# Altium project openmv-n6.PrjPcb (part 1 of 2)
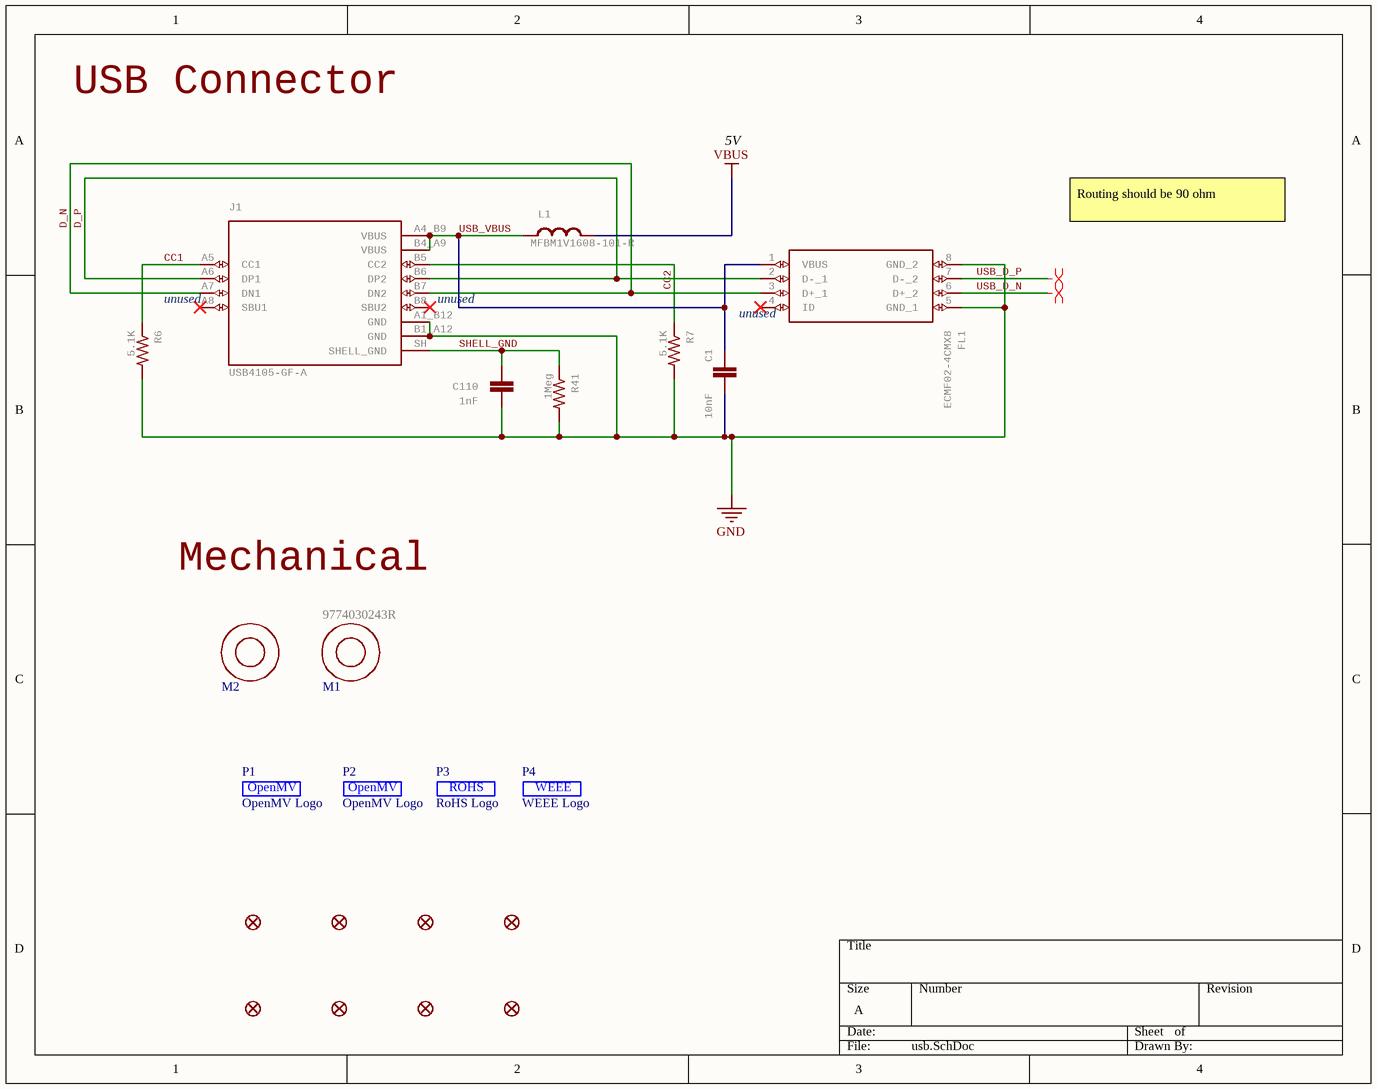
[diagram p0: usb.SchDoc]
14 sheets, 354 parts. Net scope: global (net labels, ports and power ports of the same name join across sheets).
Board file: openmv-stm32n.PcbDoc
Sheets:
  usb.SchDoc
  ideal-diode.SchDoc
  battery-charging.SchDoc
  regulators.SchDoc
  prg-flash.SchDoc
  psram.SchDoc
  imu.SchDoc
  sd-card.SchDoc
  sensor-header.SchDoc
  io-headers.SchDoc
  jtag.SchDoc
  ethernet.SchDoc
  wifi-bt.SchDoc
  stm32n657.SchDoc

## Sheet usb.SchDoc
size A

### Parts
C1  10nF  [0402-CAP]
C110  1nF  [0402-CAP]
FD1  FIDUCIAL1X2  [FIDUCIAL-1X2]  (value not drawn)
FD2  FIDUCIAL1X2  [FIDUCIAL-1X2]  (value not drawn)
FD3  FIDUCIAL1X2  [FIDUCIAL-1X2]  (value not drawn)
FD4  FIDUCIAL1X2  [FIDUCIAL-1X2]  (value not drawn)
FD5  FIDUCIAL1X2  [FIDUCIAL-1X2]  (value not drawn)
FD6  FIDUCIAL1X2  [FIDUCIAL-1X2]  (value not drawn)
FD7  FIDUCIAL1X2  [FIDUCIAL-1X2]  (value not drawn)
FD8  FIDUCIAL1X2  [FIDUCIAL-1X2]  (value not drawn)
FL1  ECMF02-4CMX8  [ECMF024CMX8]
J1  USB4105-GF-A  [GCT_USB4105-GF-A]
L1  MFBM1V1608-101-R  [0603-RES]
M1  9774030243R  [9774030243R]
M2  9774030243R  [9774030243R]  (value not drawn)
P1  OpenMV Logo  [OMV-LOGO-SMALL]  (no BOM)
P2  OpenMV Logo  [OMV-LOGO-SMALL]  (no BOM)
P3  RoHS Logo  [ROHS]  (no BOM)
P4  WEEE Logo  [WEEE]  (no BOM)
R6  5.1K  [0402-RES]
R7  5.1K  [0402-RES]
R41  1Meg  [0402-RES]

### Nets
GND: C1.2 C110.2 FL1.5(GND_1) FL1.8(GND_2) J1.A1_B12(GND) J1.B1_A12(GND) R6.2 R7.2 R41.2
VBUS: L1.2
CC1: J1.A5(CC1) R6.1
CC2: J1.B5(CC2) R7.1
D_N: FL1.3(D+_1) J1.A7(DN1) J1.B7(DN2)
D_P: FL1.2(D-_1) J1.A6(DP1) J1.B6(DP2)
SHELL_GND: C110.1 J1.SH(SHELL_GND) R41.1
USB_D_N: FL1.6(D+_2)
USB_D_P: FL1.7(D-_2)
USB_VBUS: C1.1 FL1.1(VBUS) J1.A4_B9(VBUS) J1.B4_A9(VBUS) L1.1

Not connected (* = marked no-connect by the designer): FL1 4(ID)*; J1 A8(SBU1)* B8(SBU2)*

### Layout directives
differential pair: USB_D_N, USB_D_P

### Notes on the sheet
- USB Connector
- 5V
- Routing should be 90 ohm
- unused
- (near J1) unused
- (near FL1) unused
- Mechanical
- (in symbol OMV) OpenMV

### Library data of the parts
C1 = C-EUC0201: CAPACITOR, European symbol; MPN: 0402B103K250CT; GateName_1: G$1; SymbolName_1: C-EU; POPULARITY: 0; LibraryName: rcl; DeviceSetName: C-EU; SPICEPREFIX: C; Part Number: 0402B103K250CT
C110 = CAP0402-CAP: Capacitor; MPN: VJ0402Y102JXACW1BC; GateName_1: G$1; SymbolName_1: CAP; DeviceName: 0402-CAP; LibraryName: sfe; DeviceSetName: CAP; Part Number: VJ0402Y102JXACW1BC
FD1-FD8 = FIDUCIAL1X2: Fiducial Alignment Points    Point-of-reference for pick-and-place machines and other optical instruments.; GateName_1: G$1; DeviceName: 1X2; SymbolName_1: FIDUCIAL; LibraryName: SparkFun-Aesthetics; DeviceSetName: FIDUCIAL
FL1 = ECMF02-4CMX8: Common Mode Filter & ESD Prot. USB uQFN8 STMicroelectronics ECMF02 Series, Signal Filter uQFN SMD, Flat Contact Termination, 2.6 x 1.3 x 0.6mm   Source:  Datasheet; GateName_1: G$1; SymbolName_1: ECMF02-4CMX8; LibraryName: ECMF02-4CMX8; DeviceSetName: ECMF02-4CMX8; HEIGHT: mm; MANUFACTURER_NAME: STMicroelectronics; MANUFACTURER_PART_NUMBER: ECMF02-4CMX8; MOUSER_PART_NUMBER: 511-ECMF02-4CMX8; MOUSER_PRICE-STOCK: https://www.mouser.co.uk/ProductDetail/STMicroelectronics/ECMF02-4CMX8?qs=xYt8xtm2zhmK7GoDlDZR3A%3D%3D; MPN: ECMF02-4CMX8; Part Number: ECMF02-4CMX8
J1 = USB4105-GF-A: USB-C (USB TYPE-C) USB 2.0 Receptacle Connector 24 (16+8 Dummy) Position Surface Mount, Right Angle; Through Hole  Check availability; GateName_1: G$1; MF: GCT; SymbolName_1: USB4105-GF-A; LibraryName: USB4105-GF-A; DeviceSetName: USB4105-GF-A; AVAILABILITY: In Stock; MP: USB4105-GF-A; MPN: USB4105-GF-A; PACKAGE: None; PRICE: None; PURCHASE-URL: https://pricing.snapeda.com/search/part/USB4105-GF-A/?ref=eda; Part Number: USB4105-GF-A
L1 = INDUCTOR: InductorsBasic Inductor/Choke - 0603 and 1206. Footprints are not proven and vary greatly between part numbers.; GateName_1: G$1; MPN: MFBM1V1608-101-R; Part Number: MFBM1V1608-101-R
M1 M2 = 9774030243R: M2 3mm Standoff; GateName_1: G$1; SymbolName_1: 9774030243R; LibraryName: 9774030243R; DeviceSetName: 9774030243R; MPN: 9774030243R; Part Number: 9774030243R
P1 P2 = OMV
P3 = ROHS
P4 = WEEE
R6 R7 = RESISTOR0402-RES: ResistorBasic schematic elements and footprints for 0603, 1206, and PTH resistors.; MPN: RC0402JR-075K1L; GateName_1: G$1; SymbolName_1: RESISTOR; DeviceName: 0402-RES; LibraryName: sfe; DeviceSetName: RESISTOR; Part Number: RC0402JR-075K1L
R41 = RESISTOR0402-RES: Resistor; MPN: CRCW04021M00FKEDC; GateName_1: G$1; SymbolName_1: RESISTOR; DeviceName: 0402-RES; LibraryName: sfe; DeviceSetName: RESISTOR; Part Number: CRCW04021M00FKEDC

## Sheet ideal-diode.SchDoc
size A
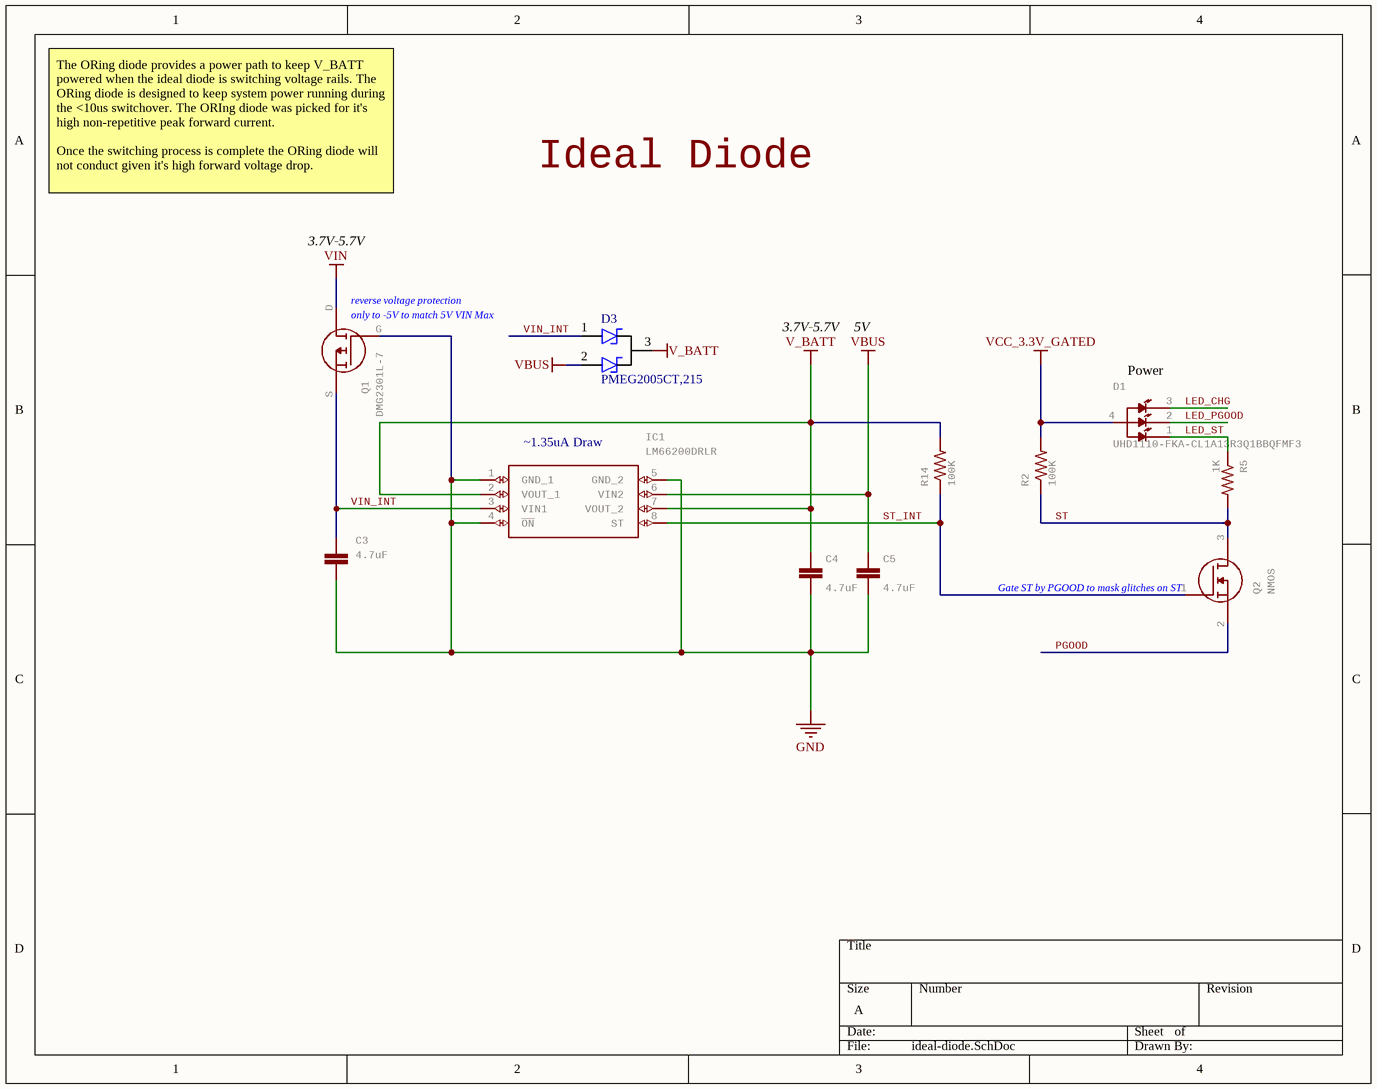
[diagram p1: ideal-diode.SchDoc]

### Parts
C3  4.7uF  [0402-CAP]
C4  4.7uF  [0402-CAP]
C5  4.7uF  [0402-CAP]
D1  UHD1110-FKA-CL1A13R3Q1BBQFMF3  [LED_UHD1110-FKA-CL1A13R3Q1BBQFMF3]
D3  MPN: PMEG2005CT,215  [SOT-23-3]  (hidden comment: Dual Schottky)
IC1  LM66200DRLR  [SOTFL50P160X60-8N]
Q1  DMG2301L-7  [SOT-23-3-FET]
Q2  NMOS  [DFN1006]
R2  100K  [0402-RES]
R5  1K  [0402-RES]
R14  100K  [0402-RES]

### Nets
GND: C3.1 C4.1 C5.1 IC1.1(GND_1) IC1.4(~{ON}) IC1.5(GND_2) Q1.G
V_BATT: C4.2 D3.3 IC1.2(VOUT_1) IC1.7(VOUT_2) R14.2
VBUS: C5.2 D3.2 IC1.6(VIN2)
VCC_3.3V_GATED: D1.4(ANODE) R2.2
VIN: Q1.D
LED_CHG: D1.3(RED)
LED_PGOOD: D1.2(GREEN)
LED_ST: D1.1(BLUE) R5.1
PGOOD: Q2.2(S)
ST: Q2.3(D) R2.1 R5.2
ST_INT: IC1.8(ST) Q2.1(G) R14.1
VIN_INT: C3.2 D3.1 IC1.3(VIN1) Q1.S

### Notes on the sheet
- Ideal Diode
- The ORing diode provides a power path to keep V_BATT powered when the ideal diode is switching voltage rails. The ORing diode is designed to keep system power running during the <10us switchover. The ORIng diode was picked for it's high non-repetitive peak forward current.
  Once the switching process is complete the ORing diode will not conduct given it's high forward voltage drop.
- 3.7V-5.7V
- (near Q1) reverse voltage protection
- (near Q1) only to -5V to match 5V VIN Max
- 5V
- (near D1) Power
- (near IC1) ~1.35uA Draw
- (near Q2) Gate ST by PGOOD to mask glitches on ST

### Library data of the parts
C3-C5 = CAP0402-CAP: CapacitorStandard 0603 ceramic capacitor, and 0.1" leaded capacitor.; MPN: JMK105BBJ475MV-F; GateName_1: G$1; SymbolName_1: CAP; DeviceName: 0402-CAP; LibraryName: sfe; DeviceSetName: CAP; Part Number: JMK105BBJ475MV-F
D1 = UHD1110-FKA-CL1A13R3Q1BBQFMF3: LED RGB SMD, SIZE 1 X 1 mm Check availability; GateName_1: G$1; MF: Cree Inc.; SymbolName_1: UHD1110-FKA-CL1A13R3Q1BBQFMF3; LibraryName: UHD1110-FKA-CL1A13R3Q1BBQFMF3; DeviceSetName: UHD1110-FKA-CL1A13R3Q1BBQFMF3; AVAILABILITY: In Stock; MP: UHD1110-FKA-CL1A13R3Q1BBQFMF3; MPN: UHD1110-FKA-CL1A13r3q1BBQFMF3; PACKAGE: 0404 Cree Inc.; PRICE: None; PURCHASE-URL: https://pricing.snapeda.com/search/part/UHD1110-FKA-CL1A13R3Q1BBQFMF3/?ref=eda; Part Number: UHD1110-FKA-CL1A13r3q1BBQFMF3
D3 = Dual Schottky: MANUFACTURER: Nexperia; Value: ?V; Part Number: PMEG2005CT,215
IC1 = LM66200DRLR: 1.6-V to 5.5-V, 40-m, 2.5-A, low-IQ, dual ideal diode   Source:  Datasheet; MANUFACTURER_NAME: Texas Instruments; GateName_1: G$1; SymbolName_1: LM66200DRLR; LibraryName: LM66200DRLR; DeviceSetName: LM66200DRLR; HEIGHT: 0.6mm; MANUFACTURER_PART_NUMBER: LM66200DRLR; MOUSER_PART_NUMBER: 595-LM66200DRLR; MOUSER_PRICE-STOCK: https://www.mouser.co.uk/ProductDetail/Texas-Instruments/LM66200DRLR?qs=Rp5uXu7WBW90hnpZAkIOdQ%3D%3D; MPN: LM66200DRLR; Part Number: LM66200DRLR
Q1 = DMG2301L-7: GateName_1: G$1; HEIGHT: 1.1mm; MPN: DMG2301L-7; Part Number: DMG2301L-7
Q2 = 2N7002KW_R1_00001: MOSFET 60V N-Channel Enhancement Mode MOSFET - ESD Protected   Source:  Datasheet
R2 R14 = RESISTOR0402-RES: ResistorBasic schematic elements and footprints for 0603, 1206, and PTH resistors.; MPN: AC0402FR-07100KL; GateName_1: G$1; SymbolName_1: RESISTOR; DeviceName: 0402-RES; LibraryName: sfe; DeviceSetName: RESISTOR; Part Number: AC0402FR-07100KL
R5 = RESISTOR0402-RES: ResistorBasic schematic elements and footprints for 0603, 1206, and PTH resistors.; MPN: CRCW04021K00FKEDC; GateName_1: G$1; SymbolName_1: RESISTOR; DeviceName: 0402-RES; LibraryName: sfe; DeviceSetName: RESISTOR; Part Number: CRCW04021K00FKEDC

## Sheet battery-charging.SchDoc
size A
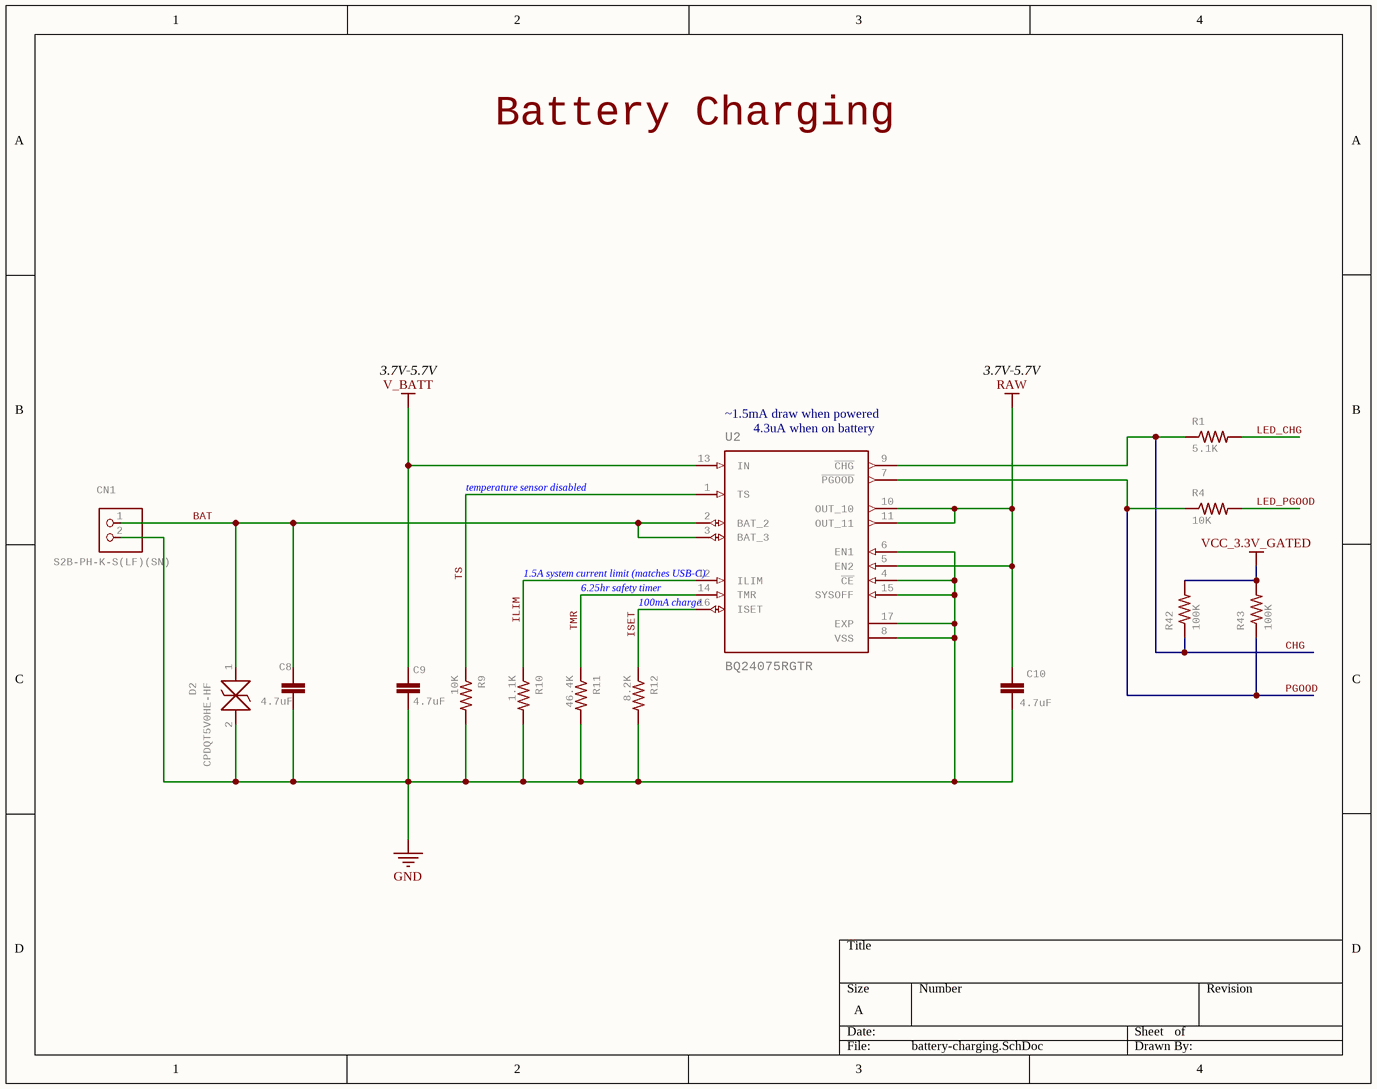
[diagram p2: battery-charging.SchDoc]

### Parts
C8  4.7uF  [0402-CAP]
C9  4.7uF  [0402-CAP]
C10  4.7uF  [0402-CAP]
CN1  S2B-PH-K-S(LF)(SN)  [JST-PH-2-THM-RA]
D2  CPDQT5V0HE-HF  [CPDQT5V0HEHF]
R1  5.1K  [0402-RES]
R4  10K  [0402-RES]
R9  10K  [0402-RES]
R10  1.1K  [0402-RES]
R11  46.4K  [0402-RES]
R12  8.2K  [0402-RES]
R42  100K  [0402-RES]
R43  100K  [0402-RES]
U2  BQ24075RGTR  [QFN50P300X300X100-17N]

### Nets
GND: C8.1 C9.1 C10.1 CN1.2 D2.2 R9.2 R10.2 R11.2 R12.2 U2.4(~{CE}) U2.6(EN1) U2.8(VSS) U2.15(SYSOFF) U2.17(EXP)
RAW: C10.2 U2.5(EN2) U2.10(OUT_10) U2.11(OUT_11)
V_BATT: C9.2 U2.13(IN)
VCC_3.3V_GATED: R42.2 R43.2
BAT: C8.2 CN1.1 D2.1 U2.2(BAT_2) U2.3(BAT_3)
CHG: R1.1 R42.1 U2.9(~{CHG})
ILIM: R10.1 U2.12(ILIM)
ISET: R12.1 U2.16(ISET)
LED_CHG: R1.2
LED_PGOOD: R4.2
PGOOD: R4.1 R43.1 U2.7(~{PGOOD})
TMR: R11.1 U2.14(TMR)
TS: R9.1 U2.1(TS)

### Notes on the sheet
- Battery Charging
- 3.7V-5.7V
- (near U2) ~1.5mA draw when powered
- (near U2) 4.3uA when on battery
- temperature sensor disabled
- (near U2) 1.5A system current limit (matches USB-C)
- (near U2) 6.25hr safety timer
- (near U2) 100mA charge

### Library data of the parts
C8-C10 = CAP0402-CAP: as C3 on sheet ideal-diode; DeviceName: 0402-CAP; LibraryName: sfe; DeviceSetName: CAP; Part Number: JMK105BBJ475MV-F
CN1 = JST_2PIN-THM-RA: JST 2-Pin Connectors of various flavors SMT-RA (S2B-PH-SM4) 4UConnector #17311  SMT  (B2B-PH-SM4)  THM-RA (S2B-PH)  THM  (B2B-PH); GateName_1: G$1; SymbolName_1: PINHD2; DeviceName: -THM-RA; LibraryName: adafruit-updated; DeviceSetName: JST_2PIN; MPN: S2B-PH-K-S(LF)(SN); Part Number: S2B-PH-K-S(LF)(SN)
D2 = CPDQT5V0HE-HF: ESD Suppressors / TVS Diodes DIODE ESD 5VWM 65W 0402/SOD-923F   Source:  Datasheet; MANUFACTURER_NAME: Comchip Technology; GateName_1: G$1; SymbolName_1: CPDQT5V0HE-HF; LibraryName: CPDQT5V0HE-HF; DeviceSetName: CPDQT5V0HE-HF; HEIGHT: 0.42mm; MANUFACTURER_PART_NUMBER: CPDQT5V0HE-HF; MOUSER_PART_NUMBER: MOUSER_PART_NUMBER; MOUSER_PRICE-STOCK: MOUSER_PRICE-STOCK; MPN: CPDQT5V0HE-HF; Part Number: CPDQT5V0HE-HF
R1 = RESISTOR0402-RES: as R6 on sheet usb; SymbolName_1: RESISTOR; DeviceName: 0402-RES; LibraryName: sfe; DeviceSetName: RESISTOR; Part Number: RC0402JR-075K1L
R4 R9 = RESISTOR0402-RES: ResistorBasic schematic elements and footprints for 0603, 1206, and PTH resistors.; MPN: AC0402FR-1310KL; GateName_1: G$1; SymbolName_1: RESISTOR; DeviceName: 0402-RES; LibraryName: sfe; DeviceSetName: RESISTOR; Part Number: AC0402FR-1310KL
R10 = RESISTOR0402-RES: ResistorBasic schematic elements and footprints for 0603, 1206, and PTH resistors.; MPN: RC0402JR-071K1; GateName_1: G$1; SymbolName_1: RESISTOR; DeviceName: 0402-RES; LibraryName: sfe; DeviceSetName: RESISTOR; Part Number: RC0402JR-071K1
R11 = RESISTOR0402-RES: ResistorBasic schematic elements and footprints for 0603, 1206, and PTH resistors.; MPN: WR04X4642FTL; GateName_1: G$1; SymbolName_1: RESISTOR; DeviceName: 0402-RES; LibraryName: sfe; DeviceSetName: RESISTOR; Part Number: WR04X4642FTL
R12 = RESISTOR0402-RES: ResistorBasic schematic elements and footprints for 0603, 1206, and PTH resistors.; MPN: CR0402-FX-8201GLF; GateName_1: G$1; SymbolName_1: RESISTOR; DeviceName: 0402-RES; LibraryName: sfe; DeviceSetName: RESISTOR; Part Number: CR0402-FX-8201GLF
R42 R43 = RESISTOR0402-RES: as R2 on sheet ideal-diode; SymbolName_1: RESISTOR; DeviceName: 0402-RES; LibraryName: sfe; DeviceSetName: RESISTOR; Part Number: AC0402FR-07100KL
U2 = BQ24075RGTR: Standalone 1-cell 1.5-A linear charger, Power Path, 4.2-V VBAT and 5.5-V VOUT 16-VQFN -40 to 85  Check availability; GateName_1: G$1; MF: Texas Instruments; SymbolName_1: BQ24075RGTR; LibraryName: BQ24075RGTR; DeviceSetName: BQ24075RGTR; AVAILABILITY: In Stock; MP: BQ24075RGTR; MPN: BQ24075RGTR; PACKAGE: VQFN-16 Texas Instruments; PRICE: None; PURCHASE-URL: https://pricing.snapeda.com/search/part/BQ24075RGTR/?ref=eda; Part Number: BQ24075RGTR

## Sheet regulators.SchDoc
size A
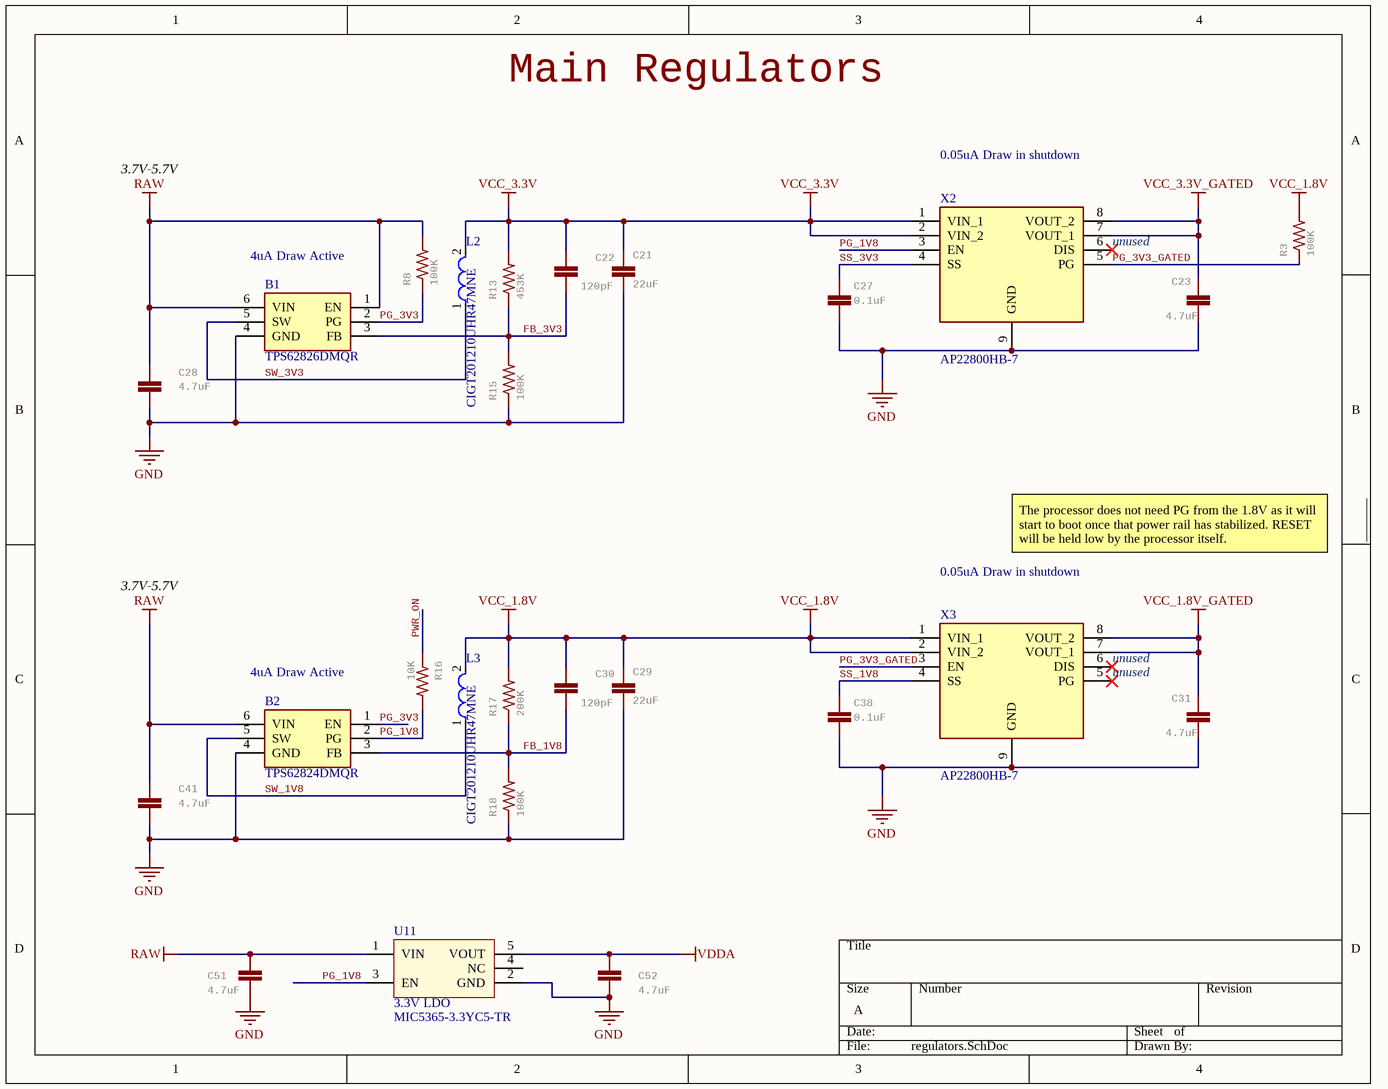
[diagram p3: regulators.SchDoc]

### Parts
B1  TPS62826DMQR  [TPS62826ADMQR]
B2  TPS62824DMQR  [TPS62826ADMQR]
C21  22uF  [0805]
C22  120pF  [0402-CAP]
C23  4.7uF  [0402-CAP]
C27  0.1uF  [0402-CAP]
C28  4.7uF  [0402-CAP]
C29  22uF  [0805]
C30  120pF  [0402-CAP]
C31  4.7uF  [0402-CAP]
C38  0.1uF  [0402-CAP]
C41  4.7uF  [0402-CAP]
C51  4.7uF  [0402-CAP]
C52  4.7uF  [0402-CAP]
L2  CIGT201210UHR47MNE  [0805]
L3  CIGT201210UHR47MNE  [0805]
R3  100K  [0402-RES]
R8  100K  [0402-RES]
R13  453K  [0402-RES]
R15  100K  [0402-RES]
R16  10K  [0402-RES]
R17  200K  [0402-RES]
R18  100K  [0402-RES]
U11  3.3V LDO  [SC70-5]
X2  AP22800HB-7  [SON50P161X211X60-9N]
X3  AP22800HB-7  [SON50P161X211X60-9N]

### Nets
GND: B1.4(GND) B2.4(GND) C21.2 C23.2 C27.1 C28.1 C29.2 C31.2 C38.1 C41.1 C51.1 C52.2 R15.1 R18.1 U11.2(GND) X2.9(GND) X3.9(GND)
RAW: B1.1(EN) B1.6(VIN) B2.6(VIN) C28.2 C41.2 C51.2 R8.2 U11.1(VIN)
VCC_1.8V: C29.1 C30.2 L3.2 R3.2 R17.2 X3.1(VIN_1) X3.2(VIN_2)
VCC_1.8V_GATED: C31.1 X3.7(VOUT_1) X3.8(VOUT_2)
VCC_3.3V: C21.1 C22.2 L2.2 R13.2 X2.1(VIN_1) X2.2(VIN_2)
VCC_3.3V_GATED: C23.1 X2.7(VOUT_1) X2.8(VOUT_2)
VDDA: C52.1 U11.5(VOUT)
FB_1V8: B2.3(FB) C30.1 R17.1 R18.2
FB_3V3: B1.3(FB) C22.1 R13.1 R15.2
PG_1V8: B2.2(PG) R16.2 U11.3(EN) X2.3(EN)
PG_3V3: B1.2(PG) B2.1(EN) R8.1
PG_3V3_GATED: R3.1 X2.5(PG) X3.3(EN)
PWR_ON: R16.1
SS_1V8: C38.2 X3.4(SS)
SS_3V3: C27.2 X2.4(SS)
SW_1V8: B2.5(SW) L3.1
SW_3V3: B1.5(SW) L2.1

Not connected (* = marked no-connect by the designer): U11 4(NC); X2 6(DIS)*; X3 5(PG)* 6(DIS)*

### Notes on the sheet
- Main Regulators
- 3.7V-5.7V
- 0.05uA Draw in shutdown
- (near X2) unused
- (near B1) 4uA Draw Active
- The processor does not need PG from the 1.8V as it will start to boot once that power rail has stabilized. RESET will be held low by the processor itself.
- (near B2) 4uA Draw Active
- (near X3) unused

### Library data of the parts
B1 = TPS62826ADMQR: Switching Voltage Regulators 2.4-V to 5.5-V input, 3-A step-down converter with in 1.5-mm 1.5-mm QFN package; Manufacturer_Name: Texas Instruments; Geometry.Height: 1mm; Mouser Part Number: 595-TPS62826DMQR; Mouser Price/Stock: https://www.mouser.co.uk/ProductDetail/Texas-Instruments/TPS62826ADMQR?qs=KUoIvG%2F9Ila3pPUbedlDEw%3D%3D; Manufacturer_Part_Number: TPS62826DMQR; Datasheet Link: https://www.ti.com/lit/ds/symlink/tps62825a.pdf?ts=1608196934558&ref_url=https%253A%252F%252Fwww.ti.com%252Fstore%252Fti%252Fen%252Fp%252Fproduct%252F%253Fp%253DTPS62825ADMQR%2526keyMatch%253DTPS62825ADMQR%2526tisearch%253DSearch-EN-everything%2526usecase; MPN: TPS62826DMQR; Part Number: TPS62826DMQR
B2 = TPS62826ADMQR: Switching Voltage Regulators 2.4-V to 5.5-V input, 1-A step-down converter in 1.5-mm 1.5-mm QFN package; Manufacturer_Name: Texas Instruments; Geometry.Height: 1mm; Mouser Part Number: 595-TPS62824DMQR; Mouser Price/Stock: https://www.mouser.co.uk/ProductDetail/Texas-Instruments/TPS62826ADMQR?qs=KUoIvG%2F9Ila3pPUbedlDEw%3D%3D; Manufacturer_Part_Number: TPS62824DMQR; Datasheet Link: https://www.ti.com/lit/ds/symlink/tps62825a.pdf?ts=1608196934558&ref_url=https%253A%252F%252Fwww.ti.com%252Fstore%252Fti%252Fen%252Fp%252Fproduct%252F%253Fp%253DTPS62825ADMQR%2526keyMatch%253DTPS62825ADMQR%2526tisearch%253DSearch-EN-everything%2526usecase; MPN: TPS62824DMQR; Part Number: TPS62824DMQR
C21 C29 = 22UF-0805-6.3V-20%: 22ÂµF ceramic capacitors    A capacitor is a passive two-terminal electrical component used to store electrical energy temporarily in an electric field.; MPN: CL21A226MQQNNNE; GateName_1: G$1; SymbolName_1: CAP; PROD_ID: CAP-08402; DeviceName: -0805-6.3V-20%; LibraryName: SparkFun-Capacitors; DeviceSetName: 22UF; Part Number: CL21A226MQQNNNE
C22 C30 = CAP0402-CAP: CapacitorStandard 0603 ceramic capacitor, and 0.1" leaded capacitor.; MPN: GRM1555C2A121GE01D; GateName_1: G$1; SymbolName_1: CAP; DeviceName: 0402-CAP; LibraryName: sfe; DeviceSetName: CAP; Part Number: GRM1555C2A121GE01D
C23 C28 C31 C41 C51 C52 = CAP0402-CAP: as C3 on sheet ideal-diode; DeviceName: 0402-CAP; LibraryName: sfe; DeviceSetName: CAP; Part Number: JMK105BBJ475MV-F
C27 C38 = C-EUC0201: CAPACITOR, European symbol; MPN: C0402C104Z4VAC; GateName_1: G$1; SymbolName_1: C-EU; POPULARITY: 0; LibraryName: rcl; DeviceSetName: C-EU; SPICEPREFIX: C; Part Number: C0402C104Z4VAC
L2 L3 = CMP-00002-1: Power Inductor : LxW size(mm) 2012 Thickness1 Inductance (uH) 20%: 0.47; Current Rating: 3.6A; Shielding: Unshielded; Test Frequency: 1MHz; DC Resistance (DCR): 31mR; Saturation Current: 5.4A; Core Material: Metal,Composite; Value: 470nH; Tolerance: 20%; Packaging: Cut Tape; Case Code (Imperial): 0805; Case/Package: 0805; RoHS Compliant: Yes; Max Operating Temperature: 125°C; Series: CIGT; Min Operating Temperature: -40°C; Mounting Technology: Surface Mount; Case Code (Metric): 2012; MPN: CIGT201210UHR47MNE; Part Number: CIGT201210UHR47MNE
R3 R8 R15 R18 = RESISTOR0402-RES: as R2 on sheet ideal-diode; SymbolName_1: RESISTOR; DeviceName: 0402-RES; LibraryName: sfe; DeviceSetName: RESISTOR; Part Number: AC0402FR-07100KL
R13 = RESISTOR0402-RES: ResistorBasic schematic elements and footprints for 0603, 1206, and PTH resistors.; MPN: CR0402-FX-4533GLF; GateName_1: G$1; SymbolName_1: RESISTOR; DeviceName: 0402-RES; LibraryName: sfe; DeviceSetName: RESISTOR; Part Number: CR0402-FX-4533GLF
R16 = RESISTOR0402-RES: as R4 on sheet battery-charging; SymbolName_1: RESISTOR; DeviceName: 0402-RES; LibraryName: sfe; DeviceSetName: RESISTOR; Part Number: AC0402FR-1310KL
R17 = RESISTOR0402-RES: ResistorBasic schematic elements and footprints for 0603, 1206, and PTH resistors.; MPN: CR0402-FX-2003GLF; GateName_1: G$1; SymbolName_1: RESISTOR; DeviceName: 0402-RES; LibraryName: sfe; DeviceSetName: RESISTOR; Part Number: CR0402-FX-2003GLF
U11 = MIC5365-3.3YC5-TR: MF: Microchip; MPN: MIC5365-3.3YC5-TR
X2 X3 = AP22800HB-7: Power Switch ICs - Power Distribution Load Switch; Manufacturer_Name: Diodes Incorporated; Geometry.Height: 0.605mm; Mouser Part Number: 621-AP22800HB-7; Mouser Price/Stock: https://www.mouser.co.uk/ProductDetail/Diodes-Incorporated/AP22800HB-7?qs=9BjnSzo86S%2FcRh3gewZ%2Ftg%3D%3D; Manufacturer_Part_Number: AP22800HB-7; Datasheet Link: https://www.diodes.com/assets/Datasheets/AP22800.pdf; MPN: AP22800HB-7; Part Number: AP22800HB-7

## Sheet prg-flash.SchDoc
size A
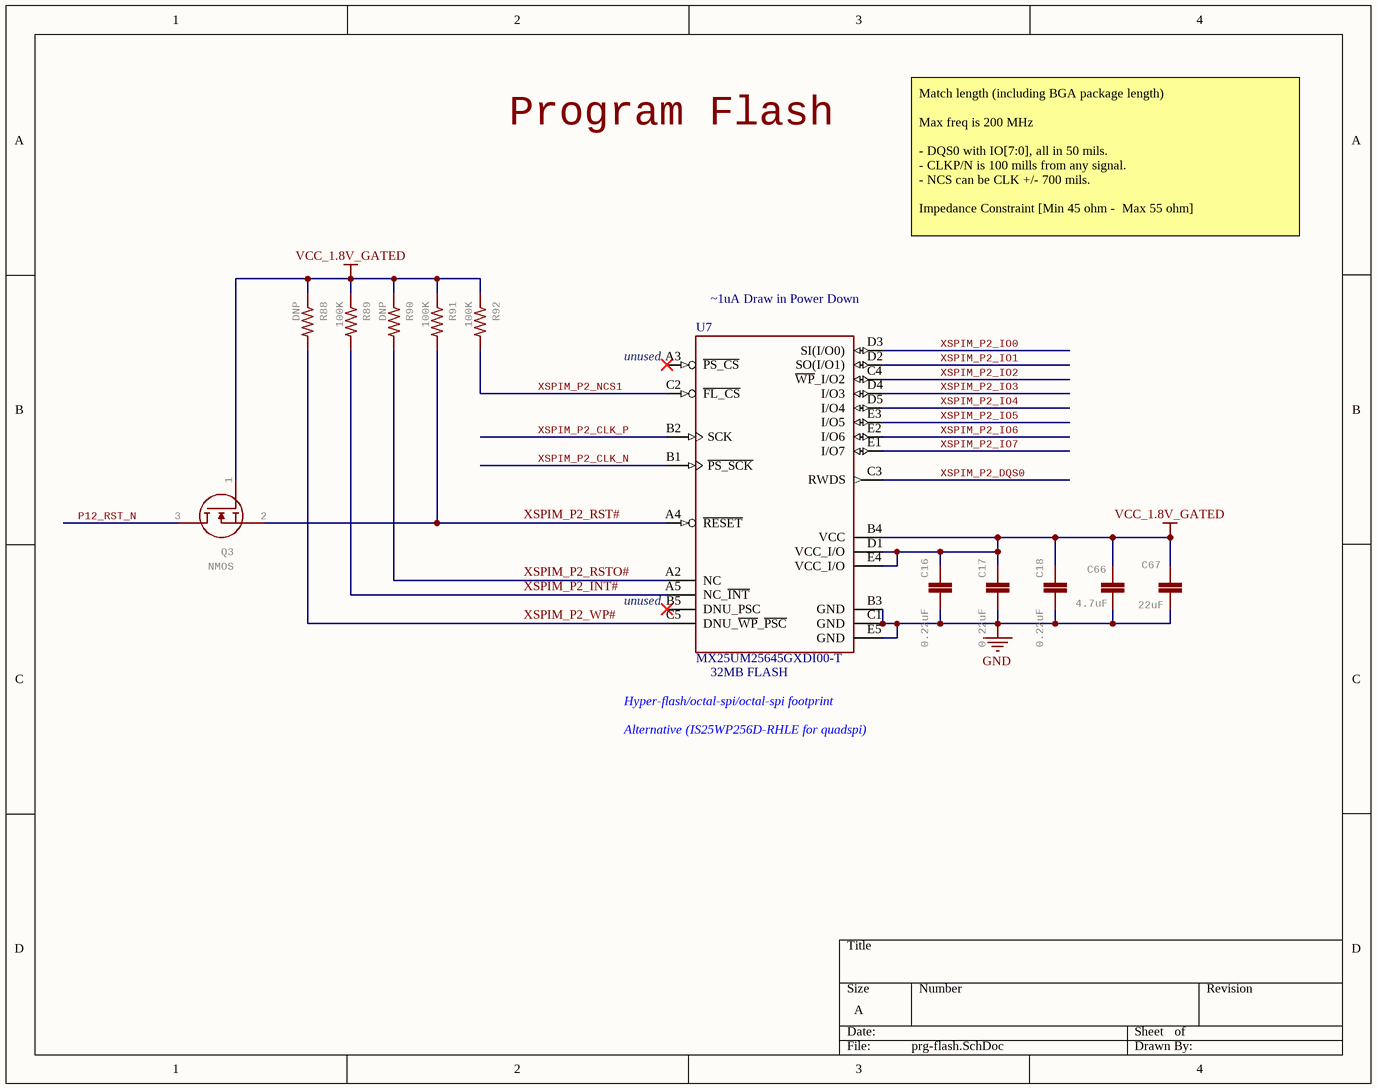
[diagram p4: prg-flash.SchDoc]

### Parts
C16  0.22uF  [C0201]
C17  0.22uF  [C0201]
C18  0.22uF  [C0201]
C66  4.7uF  [0402-CAP]
C67  22uF  [0805]
Q3  NMOS  [DFN1006]
R88  DNP  [0402-RES]
R89  100K  [0402-RES]
R90  DNP  [0402-RES]
R91  100K  [0402-RES]
R92  100K  [0402-RES]
U7  MX25UM25645GXDI00-T  [24-TBGA]

### Nets
GND: C16.2 C17.2 C18.2 C66.1 C67.1 U7.B3(GND) U7.C1(GND) U7.E5(GND)
VCC_1.8V_GATED: C16.1 C17.1 C18.1 C66.2 C67.2 Q3.1(G) R88.1 R89.1 R90.1 R91.1 R92.1 U7.B4(VCC) U7.D1(VCC_I/O) U7.E4(VCC_I/O)
P12_RST_N: Q3.3(D)
XSPIM_P2_CLK_N: U7.B1(~{PS_SCK})
XSPIM_P2_CLK_P: U7.B2(SCK)
XSPIM_P2_DQS0: U7.C3(RWDS)
XSPIM_P2_INT#: R89.2 U7.A5(NC_~{INT})
XSPIM_P2_IO0: U7.D3(SI(I/O0))
XSPIM_P2_IO1: U7.D2(SO(I/O1))
XSPIM_P2_IO2: U7.C4(~{WP}_I/O2)
XSPIM_P2_IO3: U7.D4(I/O3)
XSPIM_P2_IO4: U7.D5(I/O4)
XSPIM_P2_IO5: U7.E3(I/O5)
XSPIM_P2_IO6: U7.E2(I/O6)
XSPIM_P2_IO7: U7.E1(I/O7)
XSPIM_P2_NCS1: R92.2 U7.C2(~{FL_CS})
XSPIM_P2_RST#: Q3.2(S) R91.2 U7.A4(~{RESET})
XSPIM_P2_RSTO#: R90.2 U7.A2(NC)
XSPIM_P2_WP#: R88.2 U7.C5(DNU_~{WP}_~{PSC})

Not connected (* = marked no-connect by the designer): U7 A3(~{PS_CS})* B5(DNU_PSC)*

### Notes on the sheet
- Program Flash
- Match length (including BGA package length)
  Max freq is 200 MHz
  - DQS0 with IO[7:0], all in 50 mils.
  - CLKP/N is 100 mills from any signal.
  - NCS can be CLK +/- 700 mils.
  Impedance Constraint [Min 45 ohm -  Max 55 ohm]
- (near U7) ~1uA Draw in Power Down
- (near U7) unused
- (near U7) 32MB FLASH
- Hyper-flash/octal-spi/octal-spi footprint
- Alternative (IS25WP256D-RHLE for quadspi)

### Library data of the parts
C16-C18 = C-EUC0201: CAPACITOR, European symbol; MPN: GRM033R60J224ME15D; GateName_1: G$1; SymbolName_1: C-EU; POPULARITY: 0; DeviceName: C0201; LibraryName: rcl; DeviceSetName: C-EU; SPICEPREFIX: C; Part Number: GRM033R60J224ME15D
C66 = CAP0402-CAP: as C3 on sheet ideal-diode; DeviceName: 0402-CAP; LibraryName: sfe; DeviceSetName: CAP; Part Number: JMK105BBJ475MV-F
C67 = 22UF-0805-6.3V-20%: as C21 on sheet regulators; DeviceName: -0805-6.3V-20%; LibraryName: SparkFun-Capacitors; DeviceSetName: 22UF; Part Number: CL21A226MQQNNNE
Q3 = 2N7002KW_R1_00001: GateName_1: G$1
R88 R90 = RESISTOR0402-RES: ResistorBasic schematic elements and footprints for 0603, 1206, and PTH resistors.; GateName_1: G$1; SymbolName_1: RESISTOR; DeviceName: 0402-RES; LibraryName: sfe; DeviceSetName: RESISTOR; MPN: DNP; Part Number: DNP
R89 R91 R92 = RESISTOR0402-RES: as R2 on sheet ideal-diode; SymbolName_1: RESISTOR; DeviceName: 0402-RES; LibraryName: sfe; DeviceSetName: RESISTOR; Part Number: AC0402FR-07100KL
U7 = IS25WX256-JHLE: IC, Flash,32MB x 8, Octal SPI, Ind Temp, 1.8V,24-BGA; Part Number: MX25UM25645GXDI00-T; MPN: MX25UM25645GXDI00-T

## Sheet psram.SchDoc
size A
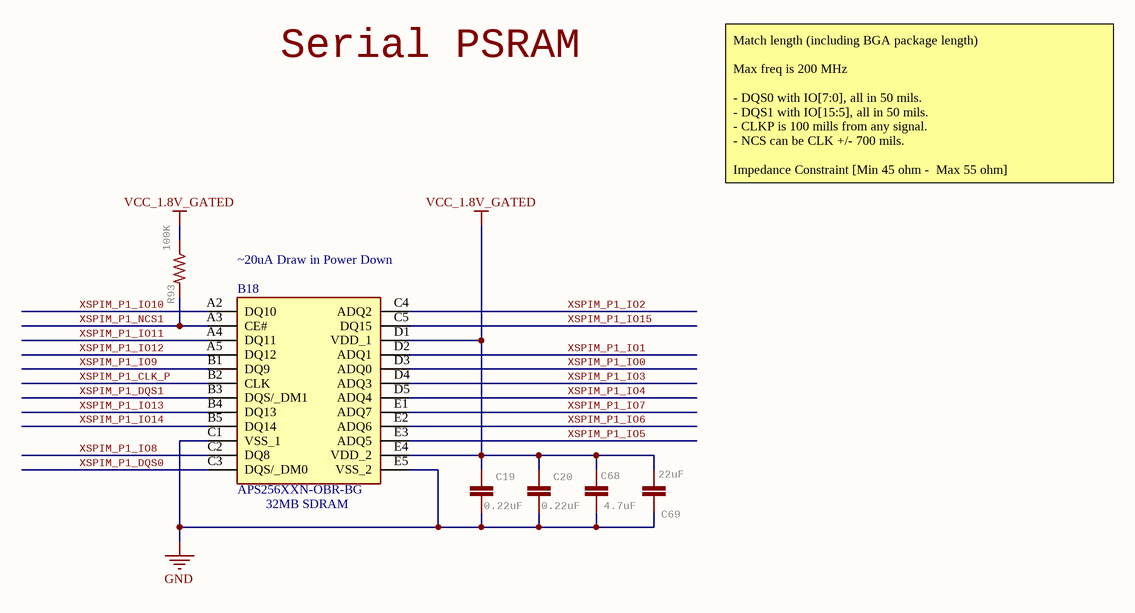
[diagram p5: psram.SchDoc]

### Parts
B18  APS256XXN-OBR-BG  [24-TBGA]
C19  0.22uF  [C0201]
C20  0.22uF  [C0201]
C68  4.7uF  [0402-CAP]
C69  22uF  [0805]
R93  100K  [0402-RES]

### Nets
GND: B18.C1(VSS_1) B18.E5(VSS_2) C19.2 C20.2 C68.1 C69.2
VCC_1.8V_GATED: B18.D1(VDD_1) B18.E4(VDD_2) C19.1 C20.1 C68.2 C69.1 R93.1
XSPIM_P1_CLK_P: B18.B2(CLK)
XSPIM_P1_DQS0: B18.C3(DQS/_DM0)
XSPIM_P1_DQS1: B18.B3(DQS/_DM1)
XSPIM_P1_IO0: B18.D3(ADQ0)
XSPIM_P1_IO1: B18.D2(ADQ1)
XSPIM_P1_IO2: B18.C4(ADQ2)
XSPIM_P1_IO3: B18.D4(ADQ3)
XSPIM_P1_IO4: B18.D5(ADQ4)
XSPIM_P1_IO5: B18.E3(ADQ5)
XSPIM_P1_IO6: B18.E2(ADQ6)
XSPIM_P1_IO7: B18.E1(ADQ7)
XSPIM_P1_IO8: B18.C2(DQ8)
XSPIM_P1_IO9: B18.B1(DQ9)
XSPIM_P1_IO10: B18.A2(DQ10)
XSPIM_P1_IO11: B18.A4(DQ11)
XSPIM_P1_IO12: B18.A5(DQ12)
XSPIM_P1_IO13: B18.B4(DQ13)
XSPIM_P1_IO14: B18.B5(DQ14)
XSPIM_P1_IO15: B18.C5(DQ15)
XSPIM_P1_NCS1: B18.A3(CE#) R93.2

### Notes on the sheet
- Serial PSRAM
- Match length (including BGA package length)
  Max freq is 200 MHz
  - DQS0 with IO[7:0], all in 50 mils.
  - DQS1 with IO[15:5], all in 50 mils.
  - CLKP is 100 mills from any signal.
  - NCS can be CLK +/- 700 mils.
  Impedance Constraint [Min 45 ohm -  Max 55 ohm]
- ~20uA Draw in Power Down
- (near B18) 32MB SDRAM

### Library data of the parts
B18 = APS256XXN-OBR-BG: DRAM IoT RAM 256Mb OPI (x8,x16) DDR 200MHz, 1.8V, Ind. Temp., BGA24; Manufacturer_Name: AP Memory; Geometry.Height: 1.2mm; Mouser Part Number: 878-APS256XXN-OBR-BG; Mouser Price/Stock: https://www.mouser.co.uk/ProductDetail/AP-Memory/APS256XXN-OBR-BG?qs=IS%252B4QmGtzzr0jQp6msfTlA%3D%3D; Manufacturer_Part_Number: APS256XXN-OBR-BG; Datasheet Link: https://www.mouser.ie/datasheet/2/1127/APM_PSRAM_OPI_Xccela_APS256XXN_OBRx_v1_0_PKG-1954780.pdf; Part Number: APS256XXN-OBR-BG; MPN: APS256XXN-OBR-BG
C19 C20 = C-EUC0201: as C16 on sheet prg-flash; DeviceName: C0201; LibraryName: rcl; DeviceSetName: C-EU; SPICEPREFIX: C; Part Number: GRM033R60J224ME15D
C68 = CAP0402-CAP: as C3 on sheet ideal-diode; DeviceName: 0402-CAP; LibraryName: sfe; DeviceSetName: CAP; Part Number: JMK105BBJ475MV-F
C69 = 22UF-0805-6.3V-20%: as C21 on sheet regulators; DeviceName: -0805-6.3V-20%; LibraryName: SparkFun-Capacitors; DeviceSetName: 22UF; Part Number: CL21A226MQQNNNE
R93 = RESISTOR0402-RES: as R2 on sheet ideal-diode; SymbolName_1: RESISTOR; DeviceName: 0402-RES; LibraryName: sfe; DeviceSetName: RESISTOR; Part Number: AC0402FR-07100KL

## Sheet imu.SchDoc
size A
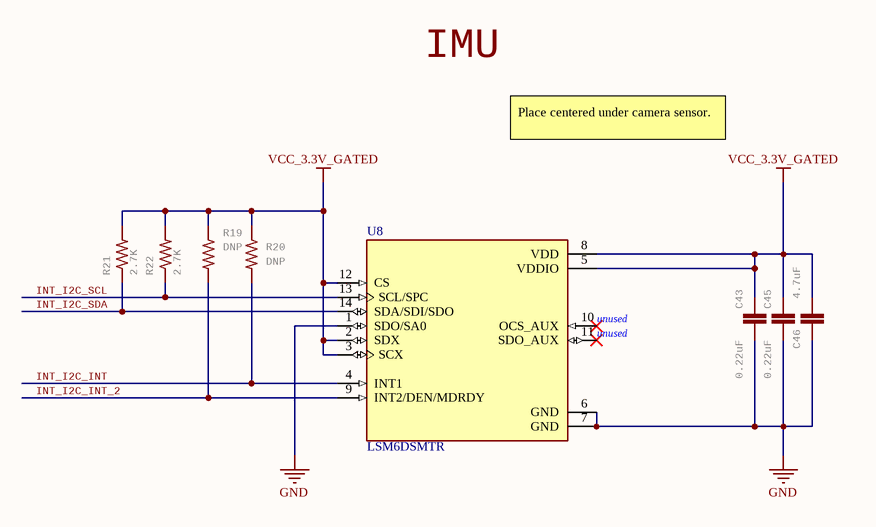
[diagram p6: imu.SchDoc]

### Parts
C43  0.22uF  [C0201]
C45  0.22uF  [C0201]
C46  4.7uF  [0402-CAP]
R19  DNP  [0402-RES]
R20  DNP  [0402-RES]
R21  2.7K  [0402-RES]
R22  2.7K  [0402-RES]
U8  LSM6DSMTR  [LSM6DSMTR]

### Nets
GND: C43.2 C45.2 C46.1 U8.1(SDO/SA0) U8.6(GND) U8.7(GND)
VCC_3.3V_GATED: C43.1 C45.1 C46.2 R19.1 R20.1 R21.2 R22.2 U8.2(SDX) U8.3(SCX) U8.5(VDDIO) U8.8(VDD) U8.12(CS)
INT_I2C_INT: R20.2 U8.4(INT1)
INT_I2C_INT_2: R19.2 U8.9(INT2/DEN/MDRDY)
INT_I2C_SCL: R22.1 U8.13(SCL/SPC)
INT_I2C_SDA: R21.1 U8.14(SDA/SDI/SDO)

Not connected (* = marked no-connect by the designer): U8 10(OCS_AUX)* 11(SDO_AUX)*

### Notes on the sheet
- IMU
- Place centered under camera sensor.
- (near U8) unused

### Library data of the parts
C43 C45 = C-EUC0201: as C16 on sheet prg-flash; DeviceName: C0201; LibraryName: rcl; DeviceSetName: C-EU; SPICEPREFIX: C; Part Number: GRM033R60J224ME15D
C46 = CAP0402-CAP: as C3 on sheet ideal-diode; DeviceName: 0402-CAP; LibraryName: sfe; DeviceSetName: CAP; Part Number: JMK105BBJ475MV-F
R19 R20 = RESISTOR0402-RES: as R88 on sheet prg-flash; SymbolName_1: RESISTOR; DeviceName: 0402-RES; LibraryName: sfe; DeviceSetName: RESISTOR; MPN: DNP; Part Number: DNP
R21 R22 = RESISTOR0402-RES: ResistorBasic schematic elements and footprints for 0603, 1206, and PTH resistors.; MPN: AC0402JR-072K7L; GateName_1: G$1; SymbolName_1: RESISTOR; DeviceName: 0402-RES; LibraryName: sfe; DeviceSetName: RESISTOR; Part Number: AC0402JR-072K7L
U8 = LSM6DSMTR: Accelerometer, Gyroscope, Temperature, 6 Axis Sensor IÂ²C, SPI Output; MF: STMicroelectronics; Design Item ID: LSM6DSMTR; Package: VFLGA-14 STMicroelectronics; Component Type: Standard; Price: None; Value: *; Pin Count: 14; SnapEDA_Link: https://www.snapeda.com/parts/LSM6DSMTR/STMicroelectronics/view-part/581716/?ref=snap; Availability: Unavailable; Source: SnapEDAsch.SchLib; MP: LSM6DSMTR; MPN: LSM6DSMTR; Part Number: LSM6DSMTR

## Sheet sd-card.SchDoc
size A
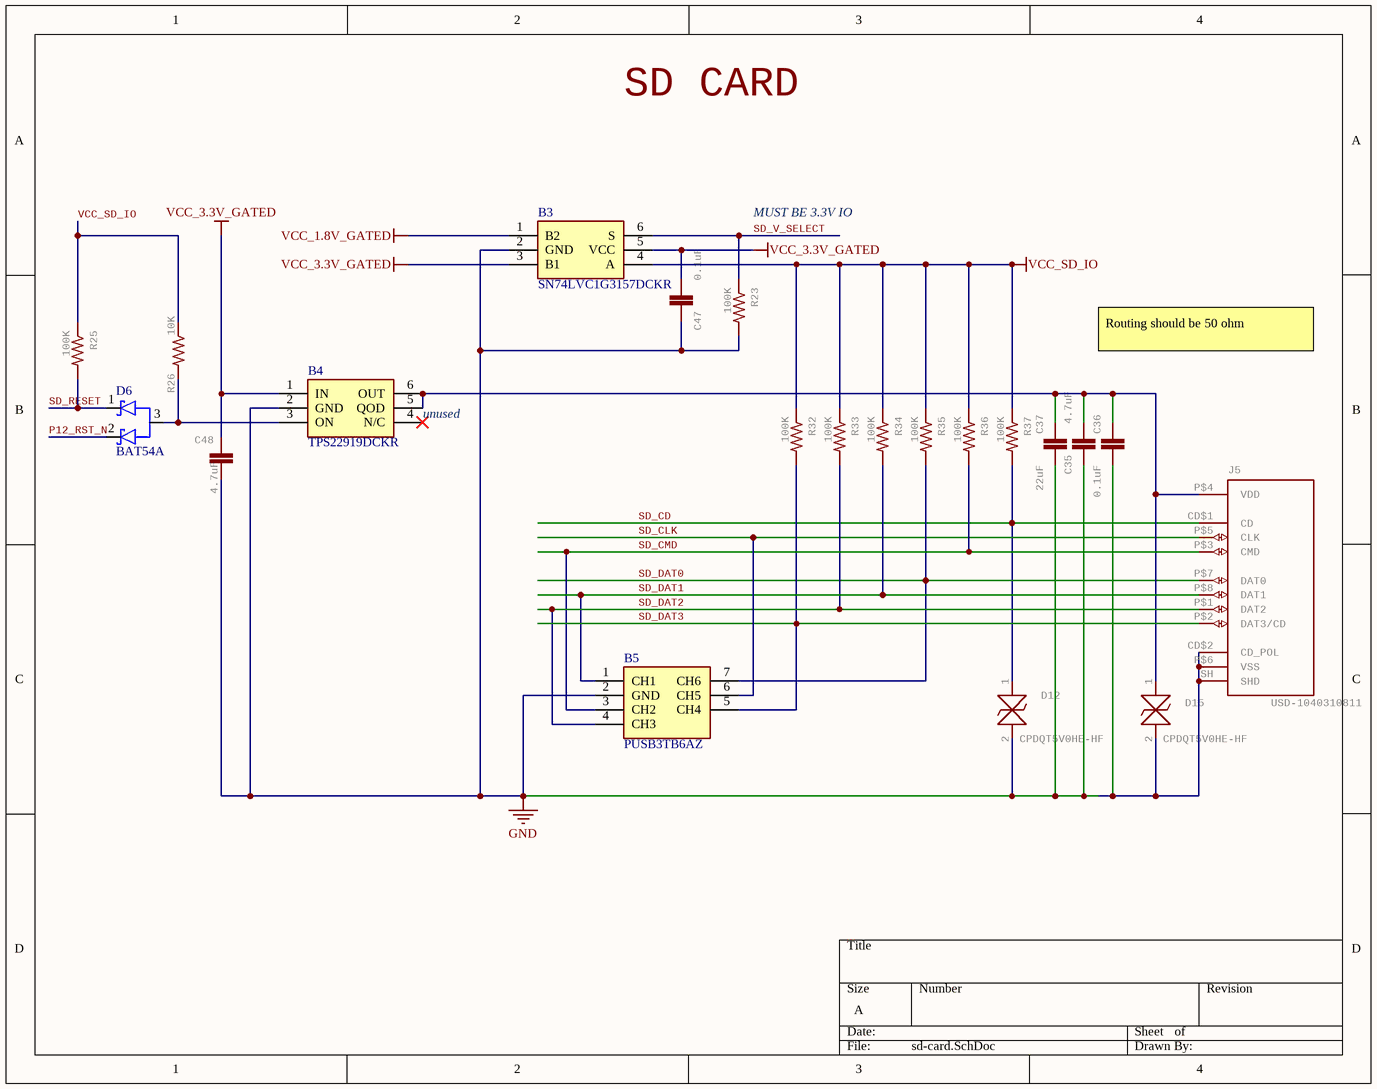
[diagram p7: sd-card.SchDoc]

### Parts
B3  SN74LVC1G3157DCKR  [SOT65P210X110-6N]
B4  TPS22919DCKR  [SOT65P210X110-6N]
B5  PUSB3TB6AZ  [PUSB3TB6AZ]
C35  4.7uF  [0402-CAP]
C36  0.1uF  [0402-CAP]
C37  22uF  [0805]
C47  0.1uF  [0402-CAP]
C48  4.7uF  [0402-CAP]
D6  BAT54A  [SOT65P210X110-3N]
D12  CPDQT5V0HE-HF  [CPDQT5V0HEHF]
D15  CPDQT5V0HE-HF  [CPDQT5V0HEHF]
J5  USD-1040310811  [1040310811]
R23  100K  [0402-RES]
R25  100K  [0402-RES]
R26  10K  [0402-RES]
R32  100K  [0402-RES]
R33  100K  [0402-RES]
R34  100K  [0402-RES]
R35  100K  [0402-RES]
R36  100K  [0402-RES]
R37  100K  [0402-RES]

### Nets
GND: B3.2(GND) B4.2(GND) B5.2(GND) C35.1 C36.2 C37.2 C47.1 C48.2 D12.2 D15.2 J5.CD$2(CD_POL) J5.P$6(VSS) J5.SH(SHD) R23.2
VCC_1.8V_GATED: B3.1(B2)
VCC_3.3V_GATED: B3.3(B1) B3.5(VCC) B4.1(IN) C47.2 C48.1
VCC_SD_IO: B3.4(A) R25.1 R26.1 R32.1 R33.1 R34.1 R35.1 R36.1 R37.1
P12_RST_N: D6.2(C2)
SD_CD: D12.1 J5.CD$1(CD) R37.2
SD_CLK: B5.6(CH5) J5.P$5(CLK)
SD_CMD: B5.3(CH2) J5.P$3(CMD) R36.2
SD_DAT0: B5.7(CH6) J5.P$7(DAT0) R35.2
SD_DAT1: B5.1(CH1) J5.P$8(DAT1) R34.2
SD_DAT2: B5.4(CH3) J5.P$1(DAT2) R33.2
SD_DAT3: B5.5(CH4) J5.P$2(DAT3/CD) R32.2
SD_RESET: D6.1(C1) R25.2
SD_V_SELECT: B3.6(S) R23.1
NetB4_3: B4.3(ON) D6.3(CA) R26.2
NetB4_5: B4.5(QOD) B4.6(OUT) C35.2 C36.1 C37.1 D15.1 J5.P$4(VDD)

Not connected (* = marked no-connect by the designer): B4 4(N/C)*

### Notes on the sheet
- SD CARD
- MUST BE 3.3V IO
- Routing should be 50 ohm
- (near B4) unused

### Library data of the parts
B3 = SN74LVC1G3157DCKR: SN74LVC1G3157DCKR, Analogue Switch Single SPDT, 3, 5V, 6-Pin, SC-70; Manufacturer_Name: Texas Instruments; Geometry.Height: 1.1mm; Mouser Part Number: 595-SN74LVC1G3157DCK; Mouser Price/Stock: https://www.mouser.co.uk/ProductDetail/Texas-Instruments/SN74LVC1G3157DCKR?qs=PVVDbbWpW3J21wbz0QWbxg%3D%3D; Manufacturer_Part_Number: SN74LVC1G3157DCKR; Datasheet Link: http://www.ti.com/lit/ds/symlink/sn74lvc1g3157.pdf; Part Number: SN74LVC1G3157DCKR; MPN: SN74LVC1G3157DCKR
B4 = TPS22919DCKR: 5.5V, 1.5A, 90m self-protected load switch with controlled rise time; Manufacturer_Name: Texas Instruments; Geometry.Height: 1.1mm; Mouser Part Number: 595-TPS22919DCKR; Mouser Price/Stock: https://www.mouser.co.uk/ProductDetail/Texas-Instruments/TPS22919DCKR?qs=byeeYqUIh0P8WJZpeizUqw%3D%3D; Manufacturer_Part_Number: TPS22919DCKR; Datasheet Link: http://www.ti.com/lit/ds/symlink/tps22919.pdf; Part Number: TPS22919DCKR; MPN: TPS22919DCKR
B5 = PUSB3TB6AZ: NEXPERIA - PUSB3TB6AZ - DIODE, ESD PROTECTION, 5.5V, 0.27PF; Geometry.Height: 0.5mm; Mouser Part Number: 771-PUSB3TB6AZ; Mouser Price/Stock: https://www.mouser.co.uk/ProductDetail/Nexperia/PUSB3TB6AZ?qs=K2OaAKmNuLgsAI4MRas6Xw%3D%3D; Manufacturer_Name: Nexperia; Manufacturer_Part_Number: PUSB3TB6AZ; Datasheet Link: https://assets.nexperia.com/documents/data-sheet/PUSB3TB6.pdf; Part Number: PUSB3TB6AZ; MPN: PUSB3TB6AZ
C35 C48 = CAP0402-CAP: as C3 on sheet ideal-diode; DeviceName: 0402-CAP; LibraryName: sfe; DeviceSetName: CAP; Part Number: JMK105BBJ475MV-F
C36 C47 = C-EUC0201: as C27 on sheet regulators; LibraryName: rcl; DeviceSetName: C-EU; SPICEPREFIX: C; Part Number: C0402C104Z4VAC
C37 = 22UF-0805-6.3V-20%: as C21 on sheet regulators; DeviceName: -0805-6.3V-20%; LibraryName: SparkFun-Capacitors; DeviceSetName: 22UF; Part Number: CL21A226MQQNNNE
D6 = BAT54AW-7-F: Diode Array 1 Pair Common Anode Schottky 30V 200mA (DC) Surface Mount SC-70, SOT-323; Part Number: BAT54AW,115; Package: None; Source: BAT54AW-7-F.SchLib; Availability: Unavailable; Price: None; MP: BAT54A; Value: *; Design Item ID: BAT54A; Component Type: Standard; Pin Count: 3; MPN: BAT54AW,115
D12 D15 = CPDQT5V0HE-HF: as D2 on sheet battery-charging; SymbolName_1: CPDQT5V0HE-HF; LibraryName: CPDQT5V0HE-HF; DeviceSetName: CPDQT5V0HE-HF; HEIGHT: 0.42mm; MANUFACTURER_PART_NUMBER: CPDQT5V0HE-HF; MOUSER_PART_NUMBER: MOUSER_PART_NUMBER; MOUSER_PRICE-STOCK: MOUSER_PRICE-STOCK; MPN: CPDQT5V0HE-HF; Part Number: CPDQT5V0HE-HF
J5 = USD-1040310811: uSD Slot; MPN: 104031-0811; GateName_1: G$1; SymbolName_1: USD; LibraryName: 1040310811; DeviceSetName: USD-1040310811; Part Number: 104031-0811
R23 R25 R32-R37 = RESISTOR0402-RES: as R2 on sheet ideal-diode; SymbolName_1: RESISTOR; DeviceName: 0402-RES; LibraryName: sfe; DeviceSetName: RESISTOR; Part Number: AC0402FR-07100KL
R26 = RESISTOR0402-RES: ResistorBasic schematic elements and footprints for 0603, 1206, and PTH resistors.; MPN: AC0402FR-1310K; GateName_1: G$1; SymbolName_1: RESISTOR; DeviceName: 0402-RES; LibraryName: sfe; DeviceSetName: RESISTOR; Part Number: AC0402FR-1310K

## Sheet sensor-header.SchDoc
size A
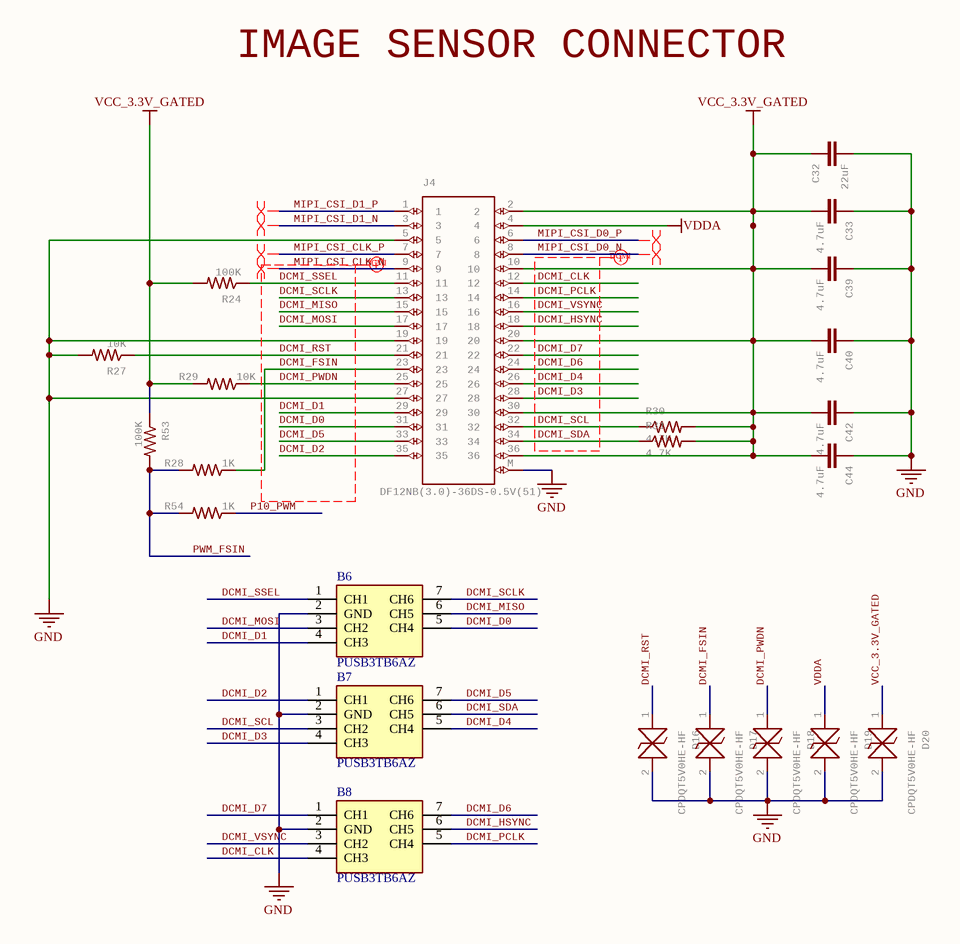
[diagram p8: sensor-header.SchDoc]

### Parts
B6  PUSB3TB6AZ  [PUSB3TB6AZ]
B7  PUSB3TB6AZ  [PUSB3TB6AZ]
B8  PUSB3TB6AZ  [PUSB3TB6AZ]
C32  22uF  [0805]
C33  4.7uF  [0402-CAP]
C39  4.7uF  [0402-CAP]
C40  4.7uF  [0402-CAP]
C42  4.7uF  [0402-CAP]
C44  4.7uF  [0402-CAP]
D16  CPDQT5V0HE-HF  [CPDQT5V0HEHF]
D17  CPDQT5V0HE-HF  [CPDQT5V0HEHF]
D18  CPDQT5V0HE-HF  [CPDQT5V0HEHF]
D19  CPDQT5V0HE-HF  [CPDQT5V0HEHF]
D20  CPDQT5V0HE-HF  [CPDQT5V0HEHF]
J4  DF12NB(3.0)-36DS-0.5V(51)  [DF12-36-DS]
R24  100K  [0402-RES]
R27  10K  [0402-RES]
R28  1K  [0402-RES]
R29  10K  [0402-RES]
R30  4.7K  [0402-RES]
R31  4.7K  [0402-RES]
R53  100K  [0402-RES]
R54  1K  [0402-RES]

### Nets
GND: B6.2(GND) B7.2(GND) B8.2(GND) C32.2 C33.1 C39.1 C40.1 C42.1 C44.1 D16.2 D17.2 D18.2 D19.2 D20.2 J4.5 J4.19 J4.27 J4.M R27.2
VCC_3.3V_GATED: C32.1 C33.2 C39.2 C40.2 C42.2 C44.2 D20.1 J4.2 J4.10 J4.20 J4.30 J4.36 R24.2 R29.2 R30.2 R31.2 R53.1
VDDA: D19.1 J4.4
DCMI_CLK: B8.4(CH3) J4.12
DCMI_D0: B6.5(CH4) J4.31
DCMI_D1: B6.4(CH3) J4.29
DCMI_D2: B7.1(CH1) J4.35
DCMI_D3: B7.4(CH3) J4.28
DCMI_D4: B7.5(CH4) J4.26
DCMI_D5: B7.7(CH6) J4.33
DCMI_D6: B8.7(CH6) J4.24
DCMI_D7: B8.1(CH1) J4.22
DCMI_FSIN: D17.1 J4.23 R28.1
DCMI_HSYNC: B8.6(CH5) J4.18
DCMI_MISO: B6.6(CH5) J4.15
DCMI_MOSI: B6.3(CH2) J4.17
DCMI_PCLK: B8.5(CH4) J4.14
DCMI_PWDN: D18.1 J4.25 R29.1
DCMI_RST: D16.1 J4.21 R27.1
DCMI_SCL: B7.3(CH2) J4.32 R30.1
DCMI_SCLK: B6.7(CH6) J4.13
DCMI_SDA: B7.6(CH5) J4.34 R31.1
DCMI_SSEL: B6.1(CH1) J4.11 R24.1
DCMI_VSYNC: B8.3(CH2) J4.16
MIPI_CSI_CLK_N: J4.9
MIPI_CSI_CLK_P: J4.7
MIPI_CSI_D0_N: J4.8
MIPI_CSI_D0_P: J4.6
MIPI_CSI_D1_N: J4.3
MIPI_CSI_D1_P: J4.1
P10_PWM: R54.1
PWM_FSIN: R28.2 R53.2 R54.2

### Layout directives
net class DCMI: DCMI_CLK, DCMI_D0, DCMI_D1, DCMI_D2, DCMI_D3, DCMI_D4, DCMI_D5, DCMI_D6, DCMI_D7, DCMI_FSIN, DCMI_HSYNC, DCMI_MISO, DCMI_MOSI, DCMI_PCLK, DCMI_PWDN, DCMI_RST, DCMI_SCL, DCMI_SCLK, DCMI_SDA, DCMI_SSEL, DCMI_VSYNC, MIPI_CSI_CLK_N
differential pair; differential pair class MIPI: MIPI_CSI_CLK_N, MIPI_CSI_CLK_P, MIPI_CSI_D0_N, MIPI_CSI_D0_P, MIPI_CSI_D1_N, MIPI_CSI_D1_P

### Notes on the sheet
- IMAGE SENSOR CONNECTOR

### Library data of the parts
B6-B8 = PUSB3TB6AZ: as B5 on sheet sd-card; Mouser Part Number: 771-PUSB3TB6AZ; Mouser Price/Stock: https://www.mouser.co.uk/ProductDetail/Nexperia/PUSB3TB6AZ?qs=K2OaAKmNuLgsAI4MRas6Xw%3D%3D; Manufacturer_Name: Nexperia; Manufacturer_Part_Number: PUSB3TB6AZ; Datasheet Link: https://assets.nexperia.com/documents/data-sheet/PUSB3TB6.pdf; Part Number: PUSB3TB6AZ; MPN: PUSB3TB6AZ
C32 = 22UF-0805-6.3V-20%: as C21 on sheet regulators; DeviceName: -0805-6.3V-20%; LibraryName: SparkFun-Capacitors; DeviceSetName: 22UF; Part Number: CL21A226MQQNNNE
C33 C39 C40 C42 C44 = CAP0402-CAP: as C3 on sheet ideal-diode; DeviceName: 0402-CAP; LibraryName: sfe; DeviceSetName: CAP; Part Number: JMK105BBJ475MV-F
D16-D20 = CPDQT5V0HE-HF: as D2 on sheet battery-charging; SymbolName_1: CPDQT5V0HE-HF; LibraryName: CPDQT5V0HE-HF; DeviceSetName: CPDQT5V0HE-HF; HEIGHT: 0.42mm; MANUFACTURER_PART_NUMBER: CPDQT5V0HE-HF; MOUSER_PART_NUMBER: MOUSER_PART_NUMBER; MOUSER_PRICE-STOCK: MOUSER_PRICE-STOCK; MPN: CPDQT5V0HE-HF; Part Number: CPDQT5V0HE-HF
J4 = DF12-36-DS: Header; GateName_1: G$1; SymbolName_1: DF12-36; LibraryName: DF12-36-DS; DeviceSetName: DF12-36-DS; MPN: DF12NB(3.0)-36DS-0.5V(51); Part Number: DF12NB(3.0)-36DS-0.5V(51)
R24 R53 = RESISTOR0402-RES: as R2 on sheet ideal-diode; SymbolName_1: RESISTOR; DeviceName: 0402-RES; LibraryName: sfe; DeviceSetName: RESISTOR; Part Number: AC0402FR-07100KL
R27 R29 = RESISTOR0402-RES: as R26 on sheet sd-card; SymbolName_1: RESISTOR; DeviceName: 0402-RES; LibraryName: sfe; DeviceSetName: RESISTOR; Part Number: AC0402FR-1310K
R28 R54 = RESISTOR0402-RES: as R5 on sheet ideal-diode; SymbolName_1: RESISTOR; DeviceName: 0402-RES; LibraryName: sfe; DeviceSetName: RESISTOR; Part Number: CRCW04021K00FKEDC
R30 R31 = RESISTOR0402-RES: ResistorBasic schematic elements and footprints for 0603, 1206, and PTH resistors.; MPN: AC0402FR-074K7L; GateName_1: G$1; SymbolName_1: RESISTOR; DeviceName: 0402-RES; LibraryName: sfe; DeviceSetName: RESISTOR; Part Number: AC0402FR-074K7L

## Sheet io-headers.SchDoc
size A
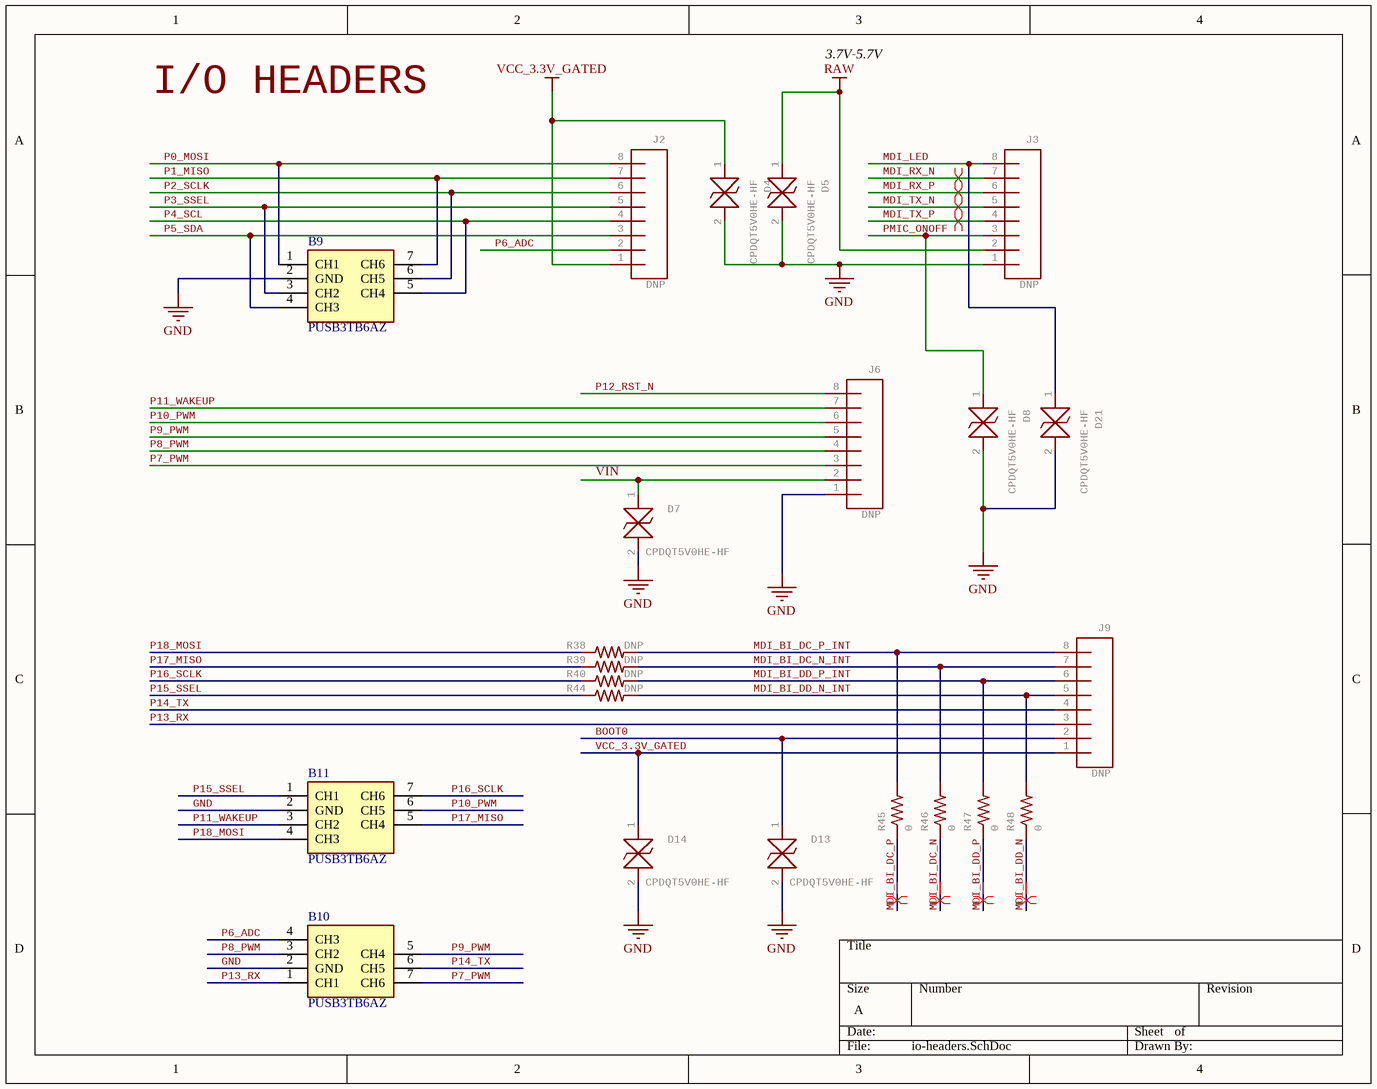
[diagram p9: io-headers.SchDoc]

### Parts
B9  PUSB3TB6AZ  [PUSB3TB6AZ]
B10  PUSB3TB6AZ  [PUSB3TB6AZ]
B11  PUSB3TB6AZ  [PUSB3TB6AZ]
D4  CPDQT5V0HE-HF  [CPDQT5V0HEHF]
D5  CPDQT5V0HE-HF  [CPDQT5V0HEHF]
D7  CPDQT5V0HE-HF  [CPDQT5V0HEHF]
D8  CPDQT5V0HE-HF  [CPDQT5V0HEHF]
D13  CPDQT5V0HE-HF  [CPDQT5V0HEHF]
D14  CPDQT5V0HE-HF  [CPDQT5V0HEHF]
D21  CPDQT5V0HE-HF  [CPDQT5V0HEHF]
J2  DNP  [1X08]
J3  DNP  [1X08]
J6  DNP  [1X08]
J9  DNP  [1X08]
R38  DNP  [0402-RES]
R39  DNP  [0402-RES]
R40  DNP  [0402-RES]
R44  DNP  [0402-RES]
R45  0  [0402-RES]
R46  0  [0402-RES]
R47  0  [0402-RES]
R48  0  [0402-RES]

### Nets
GND: B9.2(GND) B10.2(GND) B11.2(GND) D4.2 D5.2 D7.2 D8.2 D13.2 D14.2 D21.2 J3.1 J6.1
RAW: D5.1 J3.2
VCC_3.3V_GATED: D4.1 D14.1 J2.1 J9.1
VIN: D7.1 J6.2
BOOT0: D13.1 J9.2
MDI_BI_DC_N: R46.1
MDI_BI_DC_N_INT: J9.7 R39.2 R46.2
MDI_BI_DC_P: R45.1
MDI_BI_DC_P_INT: J9.8 R38.2 R45.2
MDI_BI_DD_N: R48.1
MDI_BI_DD_N_INT: J9.5 R44.2 R48.2
MDI_BI_DD_P: R47.1
MDI_BI_DD_P_INT: J9.6 R40.2 R47.2
MDI_LED: D21.1 J3.8
MDI_RX_N: J3.7
MDI_RX_P: J3.6
MDI_TX_N: J3.5
MDI_TX_P: J3.4
P0_MOSI: B9.1(CH1) J2.8
P1_MISO: B9.7(CH6) J2.7
P2_SCLK: B9.6(CH5) J2.6
P3_SSEL: B9.3(CH2) J2.5
P4_SCL: B9.5(CH4) J2.4
P5_SDA: B9.4(CH3) J2.3
P6_ADC: B10.4(CH3) J2.2
P7_PWM: B10.7(CH6) J6.3
P8_PWM: B10.3(CH2) J6.4
P9_PWM: B10.5(CH4) J6.5
P10_PWM: B11.6(CH5) J6.6
P11_WAKEUP: B11.3(CH2) J6.7
P12_RST_N: J6.8
P13_RX: B10.1(CH1) J9.3
P14_TX: B10.6(CH5) J9.4
P15_SSEL: B11.1(CH1) R44.1
P16_SCLK: B11.7(CH6) R40.1
P17_MISO: B11.5(CH4) R39.1
P18_MOSI: B11.4(CH3) R38.1
PMIC_ONOFF: D8.1 J3.3

### Layout directives
differential pair: MDI_BI_DC_N, MDI_BI_DC_P, MDI_BI_DD_N, MDI_BI_DD_P, MDI_RX_N, MDI_RX_P, MDI_TX_N, MDI_TX_P

### Notes on the sheet
- I/O HEADERS
- 3.7V-5.7V

### Library data of the parts
B9-B11 = PUSB3TB6AZ: as B5 on sheet sd-card; Mouser Part Number: 771-PUSB3TB6AZ; Mouser Price/Stock: https://www.mouser.co.uk/ProductDetail/Nexperia/PUSB3TB6AZ?qs=K2OaAKmNuLgsAI4MRas6Xw%3D%3D; Manufacturer_Name: Nexperia; Manufacturer_Part_Number: PUSB3TB6AZ; Datasheet Link: https://assets.nexperia.com/documents/data-sheet/PUSB3TB6.pdf; Part Number: PUSB3TB6AZ; MPN: PUSB3TB6AZ
D4 D5 D7 D8 D13 D14 D21 = CPDQT5V0HE-HF: as D2 on sheet battery-charging; SymbolName_1: CPDQT5V0HE-HF; LibraryName: CPDQT5V0HE-HF; DeviceSetName: CPDQT5V0HE-HF; HEIGHT: 0.42mm; MANUFACTURER_PART_NUMBER: CPDQT5V0HE-HF; MOUSER_PART_NUMBER: MOUSER_PART_NUMBER; MOUSER_PRICE-STOCK: MOUSER_PRICE-STOCK; MPN: CPDQT5V0HE-HF; Part Number: CPDQT5V0HE-HF
J2 J3 J6 J9 = CONN_08": Multi connection point. Often used as Generic Header-pin footprint for 0.1 inch spaced/style header connections    On any of the 0.1 inch spaced packages, you can populate with these:  Break Away Headers - Straight (PRT-00116)   Break Away Male Headers - Right Angle (PRT-00553)   Female Headers (PRT-00115)   Break Away Headers - Machine Pin (PRT-00117)   Break Away Female Headers - Swiss Machine Pin (PRT-00743)   Arduino Stackable Header - 8 Pin (PRT-09279)        For SCREWTERMINALS and SPRING TERMINALS visit here:  Screw Terimnals on SparkFun.com (5mm/3.5mm/2.54mm spacing)       This device is also useful as a general connection point to wire up your design to another part of your project. Our various solder wires solder well into these plated through hole pads.  Hook-Up Wire - Assortment (Stranded, 22 AWG) (PRT-11375)   Hook-Up Wire - Assortment (Solid Core, 22 AWG) (PRT-11367)   View the entire wire category on our website here          Special notes:     Molex polarized connector foot print use with SKU : PRT-08231 with associated crimp pins and housings. 1MM SMD Version SKU: PRT-10208    NOTES ON THE VARIANTS LOCK and LOCK_LONGPADS... This footprint was designed to help hold the alignment of a through-hole component (i.e.  6-pin header) while soldering it into place. You may notice that each hole has been shifted either up or down by 0.005 of an inch from it's more standard position (which is a perfectly straight line).  This slight alteration caused the pins (the squares in the middle) to touch the edges of the holes.  Because they are alternating, it causes a "brace" to hold the component in place.  0.005 has proven to be the perfect amount of "off-center" position when using our standard breakaway headers. Although looks a little odd when you look at the bare footprint, once you have a header in there, the alteration is very hard to notice.  Also,if you push a header all the way into place, it is covered up entirely on the bottom side.; GateName_1: G$1; DeviceName: "; POPULATE: 0; PROD_ID: CONN-08438; SymbolName_1: CONN_08; LibraryName: SparkFun-Connectors; DeviceSetName: CONN_08; MPN: DNP; Part Number: DNP
R38-R40 R44 = RESISTOR0402-RES: as R88 on sheet prg-flash; SymbolName_1: RESISTOR; DeviceName: 0402-RES; LibraryName: sfe; DeviceSetName: RESISTOR; MPN: DNP; Part Number: DNP
R45-R48 = RESISTOR0402-RES: ResistorBasic schematic elements and footprints for 0603, 1206, and PTH resistors.; MPN: RC0402JR-070R; GateName_1: G$1; SymbolName_1: RESISTOR; DeviceName: 0402-RES; LibraryName: sfe; DeviceSetName: RESISTOR; Part Number: RC0402JR-070R

## Sheet jtag.SchDoc
size A
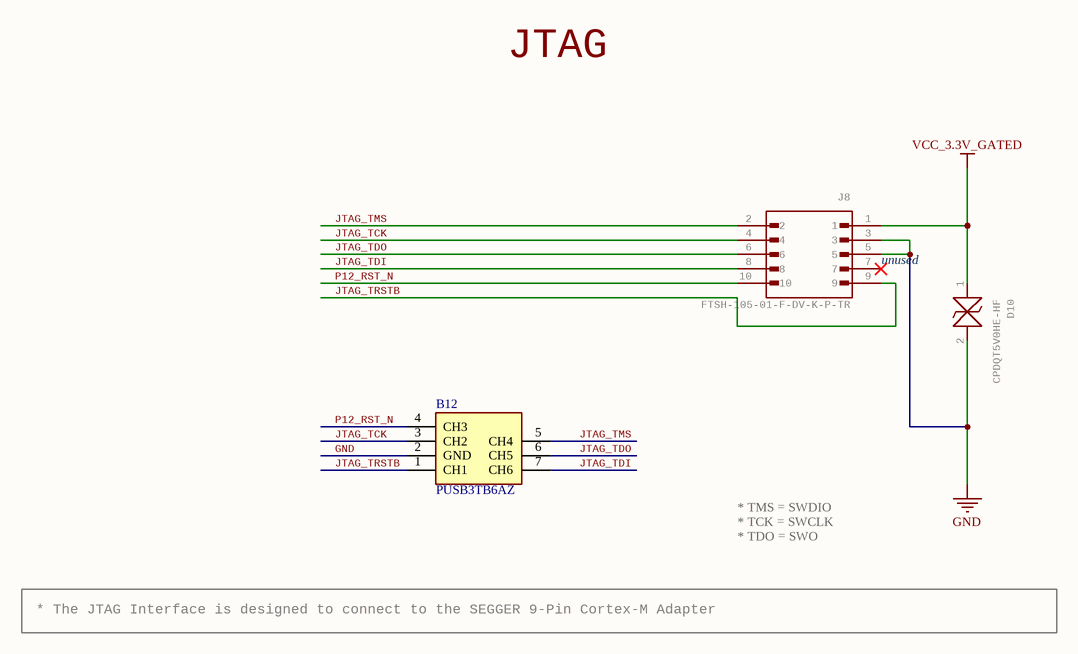
[diagram p10: jtag.SchDoc]

### Parts
B12  PUSB3TB6AZ  [PUSB3TB6AZ]
D10  CPDQT5V0HE-HF  [CPDQT5V0HEHF]
J8  FTSH-105-01-F-DV-K-P-TR  [CNC_3221-10-0300-00]

### Nets
GND: B12.2(GND) D10.2 J8.3 J8.5
VCC_3.3V_GATED: D10.1 J8.1
JTAG_TCK: B12.3(CH2) J8.4
JTAG_TDI: B12.7(CH6) J8.8
JTAG_TDO: B12.6(CH5) J8.6
JTAG_TMS: B12.5(CH4) J8.2
JTAG_TRSTB: B12.1(CH1) J8.9
P12_RST_N: B12.4(CH3) J8.10

Not connected (* = marked no-connect by the designer): J8 7*

### Notes on the sheet
- JTAG
- (near J8) unused
- * The JTAG Interface is designed to connect to the SEGGER 9-Pin Cortex-M Adapter
- * TMS = SWDIO
  * TCK = SWCLK
  * TDO = SWO

### Library data of the parts
B12 = PUSB3TB6AZ: as B5 on sheet sd-card; Mouser Part Number: 771-PUSB3TB6AZ; Mouser Price/Stock: https://www.mouser.co.uk/ProductDetail/Nexperia/PUSB3TB6AZ?qs=K2OaAKmNuLgsAI4MRas6Xw%3D%3D; Manufacturer_Name: Nexperia; Manufacturer_Part_Number: PUSB3TB6AZ; Datasheet Link: https://assets.nexperia.com/documents/data-sheet/PUSB3TB6.pdf; Part Number: PUSB3TB6AZ; MPN: PUSB3TB6AZ
D10 = CPDQT5V0HE-HF: as D2 on sheet battery-charging; SymbolName_1: CPDQT5V0HE-HF; LibraryName: CPDQT5V0HE-HF; DeviceSetName: CPDQT5V0HE-HF; HEIGHT: 0.42mm; MANUFACTURER_PART_NUMBER: CPDQT5V0HE-HF; MOUSER_PART_NUMBER: MOUSER_PART_NUMBER; MOUSER_PRICE-STOCK: MOUSER_PRICE-STOCK; MPN: CPDQT5V0HE-HF; Part Number: CPDQT5V0HE-HF
J8 = 3221-10-0300-00: Check availability; GateName_1: G$1; MF: CNC Tech; SymbolName_1: 3221-10-0300-00; LibraryName: 3221-10-0300-00; DeviceSetName: 3221-10-0300-00; AVAILABILITY: In Stock; MP: FTSH-105-01-F-DV-K-P-TR; MPN: FTSH-105-01-F-DV-K-P-TR; PACKAGE: None; PRICE: None; PURCHASE-URL: https://pricing.snapeda.com/search/part/3221-10-0300-00/?ref=eda; Part Number: FTSH-105-01-F-DV-K-P-TR

## Sheet ethernet.SchDoc
size A
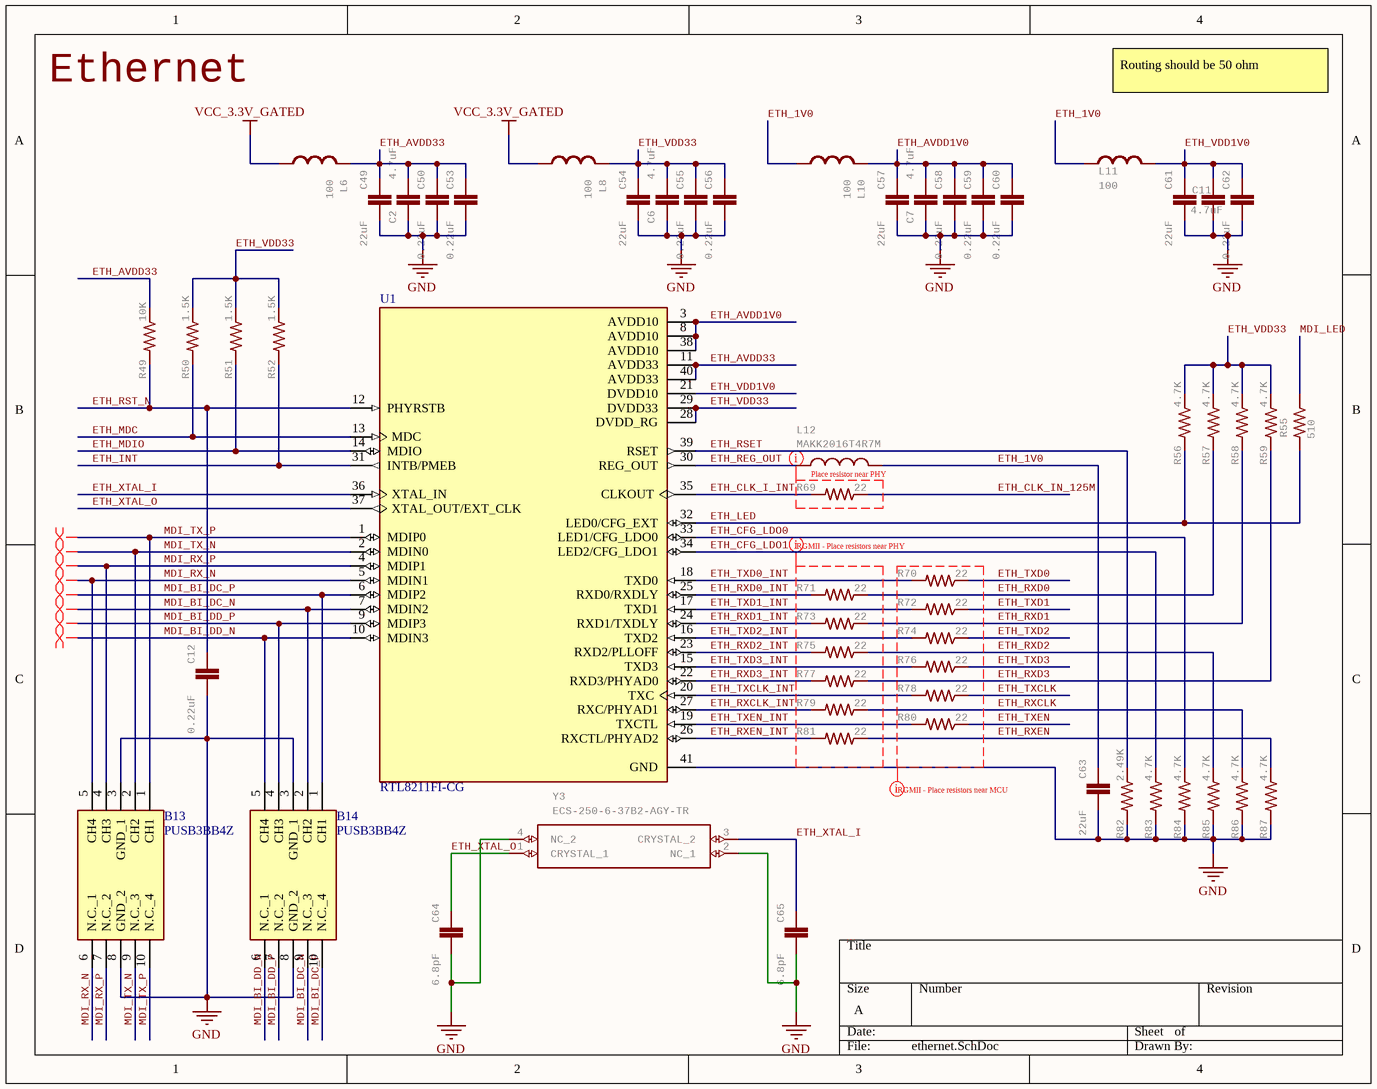
[diagram p11: ethernet.SchDoc]

### Parts
B13  PUSB3BB4Z  [SON50P100X250X50-10N]
B14  PUSB3BB4Z  [SON50P100X250X50-10N]
C2  4.7uF  [0402-CAP]
C6  4.7uF  [0402-CAP]
C7  4.7uF  [0402-CAP]
C11  4.7uF  [0402-CAP]
C12  0.22uF  [C0201]
C49  22uF  [0603-CAP]
C50  0.22uF  [C0201]
C53  0.22uF  [C0201]
C54  22uF  [0603-CAP]
C55  0.22uF  [C0201]
C56  0.22uF  [C0201]
C57  22uF  [0603-CAP]
C58  0.22uF  [C0201]
C59  0.22uF  [C0201]
C60  0.22uF  [C0201]
C61  22uF  [0603-CAP]
C62  0.22uF  [C0201]
C63  22uF  [0603-CAP]
C64  6.8pF  [C0201]
C65  6.8pF  [C0201]
L6  100  [C0402]
L8  100  [C0402]
L10  100  [C0402]
L11  100  [C0402]
L12  MAKK2016T4R7M  [INDC2016X100N]
R49  10K  [R0201]
R50  1.5K  [R0201]
R51  1.5K  [R0201]
R52  1.5K  [R0201]
R55  510  [0402-RES]
R56  4.7K  [R0201]
R57  4.7K  [R0201]
R58  4.7K  [R0201]
R59  4.7K  [R0201]
R69  22  [R0201]
R70  22  [R0201]
R71  22  [R0201]
R72  22  [R0201]
R73  22  [R0201]
R74  22  [R0201]
R75  22  [R0201]
R76  22  [R0201]
R77  22  [R0201]
R78  22  [R0201]
R79  22  [R0201]
R80  22  [R0201]
R81  22  [R0201]
R82  2.49K  [R0201]
R83  4.7K  [R0201]
R84  4.7K  [R0201]
R85  4.7K  [R0201]
R86  4.7K  [R0201]
R87  4.7K  [R0201]
U1  RTL8211FI-CG  [RTL8211FI-CG]
Y3  ECS-250-6-37B2-AGY-TR  [XRCGB24M000F3M00R0]

### Nets
GND: B13.3(GND_1) B13.8(GND_2) B14.3(GND_1) B14.8(GND_2) C2.1 C6.1 C7.1 C11.1 C12.2 C49.2 C50.2 C53.2 C54.2 C55.2 C56.2 C57.2 C58.2 C59.2 C60.2 C61.2 C62.2 C63.2 C64.2 C65.2 R82.2 R83.2 R84.2 R85.2 R86.2 R87.2 U1.41(GND) Y3.2(NC_1) Y3.4(NC_2)
VCC_3.3V_GATED: L6.1 L8.1
ETH_1V0: C63.1 L10.1 L11.1 L12.2
ETH_AVDD1V0: C7.2 C57.1 C58.1 C59.1 C60.1 L10.2 U1.3(AVDD10) U1.8(AVDD10) U1.38(AVDD10)
ETH_AVDD33: C2.2 C49.1 C50.1 C53.1 L6.2 R49.1 U1.11(AVDD33) U1.40(AVDD33)
ETH_CFG_LDO0: R84.1 U1.33(LED1/CFG_LDO0)
ETH_CFG_LDO1: R83.1 U1.34(LED2/CFG_LDO1)
ETH_CLK_I_INT: R69.2 U1.35(CLKOUT)
ETH_CLK_IN_125M: R69.1
ETH_INT: R52.2 U1.31(INTB/PMEB)
ETH_LED: R55.2 R56.2 U1.32(LED0/CFG_EXT)
ETH_MDC: R50.2 U1.13(MDC)
ETH_MDIO: R51.2 U1.14(MDIO)
ETH_REG_OUT: L12.1 U1.30(REG_OUT)
ETH_RSET: R82.1 U1.39(RSET)
ETH_RST_N: C12.1 R49.2 U1.12(PHYRSTB)
ETH_RXCLK: R79.1 R86.1
ETH_RXCLK_INT: R79.2 U1.27(RXC/PHYAD1)
ETH_RXD0: R57.2 R71.1
ETH_RXD0_INT: R71.2 U1.25(RXD0/RXDLY)
ETH_RXD1: R58.2 R73.1
ETH_RXD1_INT: R73.2 U1.24(RXD1/TXDLY)
ETH_RXD2: R75.1 R85.1
ETH_RXD2_INT: R75.2 U1.23(RXD2/PLLOFF)
ETH_RXD3: R59.2 R77.1
ETH_RXD3_INT: R77.2 U1.22(RXD3/PHYAD0)
ETH_RXEN: R81.1 R87.1
ETH_RXEN_INT: R81.2 U1.26(RXCTL/PHYAD2)
ETH_TXCLK: R78.1
ETH_TXCLK_INT: R78.2 U1.20(TXC)
ETH_TXD0: R70.1
ETH_TXD0_INT: R70.2 U1.18(TXD0)
ETH_TXD1: R72.1
ETH_TXD1_INT: R72.2 U1.17(TXD1)
ETH_TXD2: R74.1
ETH_TXD2_INT: R74.2 U1.16(TXD2)
ETH_TXD3: R76.1
ETH_TXD3_INT: R76.2 U1.15(TXD3)
ETH_TXEN: R80.1
ETH_TXEN_INT: R80.2 U1.19(TXCTL)
ETH_VDD1V0: C11.2 C61.1 C62.1 L11.2 U1.21(DVDD10)
ETH_VDD33: C6.2 C54.1 C55.1 C56.1 L8.2 R50.1 R51.1 R52.1 R56.1 R57.1 R58.1 R59.1 U1.28(DVDD_RG) U1.29(DVDD33)
ETH_XTAL_I: C65.1 U1.36(XTAL_IN) Y3.3(CRYSTAL_2)
ETH_XTAL_O: C64.1 U1.37(XTAL_OUT/EXT_CLK) Y3.1(CRYSTAL_1)
MDI_BI_DC_N: B14.2(CH2) B14.9(N.C._3) U1.7(MDIN2)
MDI_BI_DC_P: B14.1(CH1) B14.10(N.C._4) U1.6(MDIP2)
MDI_BI_DD_N: B14.5(CH4) B14.6(N.C._1) U1.10(MDIN3)
MDI_BI_DD_P: B14.4(CH3) B14.7(N.C._2) U1.9(MDIP3)
MDI_LED: R55.1
MDI_RX_N: B13.5(CH4) B13.6(N.C._1) U1.5(MDIN1)
MDI_RX_P: B13.4(CH3) B13.7(N.C._2) U1.4(MDIP1)
MDI_TX_N: B13.2(CH2) B13.9(N.C._3) U1.2(MDIN0)
MDI_TX_P: B13.1(CH1) B13.10(N.C._4) U1.1(MDIP0)

### Layout directives
net class RGMII - Place resistors near PHY: (no net found under the mark)
net class RGMII - Place resistors near MCU: GND
differential pair: MDI_BI_DC_N, MDI_BI_DC_P, MDI_BI_DD_N, MDI_BI_DD_P, MDI_RX_N, MDI_RX_P, MDI_TX_N, MDI_TX_P
net class Place resistor near PHY: (no net found under the mark)

### Notes on the sheet
- Ethernet
- Routing should be 50 ohm

### Library data of the parts
B13 B14 = PUSB3BB4Z: PUSB3BB4 - Extremely low capacitance bidirectional ESD protection diode array@en-us; Manufacturer_Name: Nexperia; Geometry.Height: 0.5mm; Mouser Part Number: 771-PUSB3BB4Z; Mouser Price/Stock: https://www.mouser.co.uk/ProductDetail/Nexperia/PUSB3BB4Z?qs=1Kr7Jg1SGW9sIg06EAYF6Q%3D%3D; Manufacturer_Part_Number: PUSB3BB4Z; Datasheet Link: https://assets.nexperia.com/documents/short-data-sheet/PUSB3BB4_SDS.pdf
C2 C6 C7 C11 = CAP0402-CAP: as C3 on sheet ideal-diode; DeviceName: 0402-CAP; LibraryName: sfe; DeviceSetName: CAP; Part Number: JMK105BBJ475MV-F
C12 C50 C53 C55 C56 C58-C60 C62 = C-EUC0201: as C16 on sheet prg-flash; DeviceName: C0201; LibraryName: rcl; DeviceSetName: C-EU; SPICEPREFIX: C; Part Number: GRM033R60J224ME15D
C49 C54 C57 C61 C63 = 22UF-0805-6.3V-20%: 22ÂµF ceramic capacitors    A capacitor is a passive two-terminal electrical component used to store electrical energy temporarily in an electric field.; MPN: GRM188R60G226MEA0D; GateName_1: G$1; SymbolName_1: CAP; PROD_ID: CAP-08402; DeviceName: -0805-6.3V-20%; LibraryName: SparkFun-Capacitors; DeviceSetName: 22UF; Part Number: GRM188R60G226MEA0D
C64 C65 = C-EUC0201: CAPACITOR, European symbol; MPN: GRM0335C1H6R8BA01D; GateName_1: G$1; SymbolName_1: C-EU; POPULARITY: 0; DeviceName: C0201; LibraryName: rcl; DeviceSetName: C-EU; SPICEPREFIX: C; Part Number: GRM0335C1H6R8BA01D
L6 L8 L10 L11 = INDUCTOR0402: InductorsBasic Inductor/Choke - 0603 and 1206. Footprints are not proven and vary greatly between part numbers.; MPN: MFBM1V1005-101-R; GateName_1: G$1; DeviceName: 0402; SymbolName_1: INDUCTOR; LibraryName: sfe; DeviceSetName: INDUCTOR; Part Number: MFBM1V1005-101-R
L12 = MAKK2016T2R2M: INDUCTOR, METAL CORE Check availability; GateName_1: G$1; MF: Taiyo Yuden; SymbolName_1: MAKK2016T4R7M; LibraryName: MAKK2016T4R7M; DeviceSetName: MAKK2016T4R7M; AVAILABILITY: In Stock; MP: MAKK2016T4R7M; MPN: MAKK2016T4R7M; PACKAGE: 2016 Taiyo Yuden; PRICE: None; PURCHASE-URL: https://pricing.snapeda.com/search/part/MAKK2016T4R7M/?ref=eda; Part Number: MAKK2016T4R7M
R49 = RESISTOR0402-RES: MPN: CR0201-JW-103GLF; GateName_1: G$1; SymbolName_1: RESISTOR; LibraryName: sfe; DeviceSetName: RESISTOR; Part Number: CR0201-JW-103GLF
R50-R52 = RESISTOR0402-RES: MPN: AC0201JR-071K5L; GateName_1: G$1; SymbolName_1: RESISTOR; LibraryName: sfe; DeviceSetName: RESISTOR; Part Number: AC0201JR-071K5L
R55 = RESISTOR0402-RES: ResistorBasic schematic elements and footprints for 0603, 1206, and PTH resistors.; MPN: RC0402FR-07510RL; GateName_1: G$1; SymbolName_1: RESISTOR; DeviceName: 0402-RES; LibraryName: sfe; DeviceSetName: RESISTOR; Part Number: RC0402FR-07510RL
R56-R59 R83-R87 = RESISTOR0402-RES: MPN: CR0201-FW-4701GLF; GateName_1: G$1; SymbolName_1: RESISTOR; LibraryName: sfe; DeviceSetName: RESISTOR; Part Number: CR0201-FW-4701GLF
R69-R81 = RESISTOR0402-RES: MPN: CR0201-JW-220GLF; GateName_1: G$1; SymbolName_1: RESISTOR; LibraryName: sfe; DeviceSetName: RESISTOR; Part Number: CR0201-JW-220GLF
R82 = RESISTOR0402-RES: MPN: RC0201FR-072K49L; GateName_1: G$1; SymbolName_1: RESISTOR; LibraryName: sfe; DeviceSetName: RESISTOR; Part Number: RC0201FR-072K49L
U1 = RTL8211F-CG: GbE PHY with RGMIII interface & EEE feature (Switch Regulator), QFN40; MF: Realtek Semiconductor Corp; Package: None; Pin Count: 41; Availability: In Stock; Price: None; Value: *; SnapEDA_Link: https://www.snapeda.com/parts/RTL8211F-CG/Realtek/view-part/?ref=snap; Design Item ID: RTL8211F-CG; Component Type: Standard; Check_prices: https://www.snapeda.com/parts/RTL8211F-CG/Realtek/view-part/?ref=eda; MP: RTL8211F-CG; Source: RTL8211F-CG.SchLib; Part Number: RTL8211FI-CG; MPN: RTL8211FI-CG
Y3 = XRCGB24M000F3M00R0: Murata 48MHz Crystal +/-30ppm SMD 4-Pin 2 x 1.6 x 0.7mm   Source:  Datasheet; MANUFACTURER_NAME: Murata Electronics; MANUFACTURER_PART_NUMBER: XRCGB48M000F0L00R0; GateName_1: G$1; SymbolName_1: ECS-250-6-37B2-AGY-TR; LibraryName: ECS-250-6-37B2-AGY-TR; DeviceSetName: ECS-250-6-37B2-AGY-TR; HEIGHT: mm; MOUSER_PART_NUMBER: 81-XRCGB48M000F0L00R0; MOUSER_PRICE-STOCK: https://www.mouser.com/ProductDetail/Murata-Electronics/XRCGB48M000F0L00R0?qs=e%252BE4OD6MgMeeUSmgUp7uPA%3D%3D; MPN: XRCGB48M000F0L00R0; Part Number: XRCGB48M000F0L00R0